# EAGLE design SatNOGSBoard (EAGLE 7.2.0)

## Sheet 1 of 14
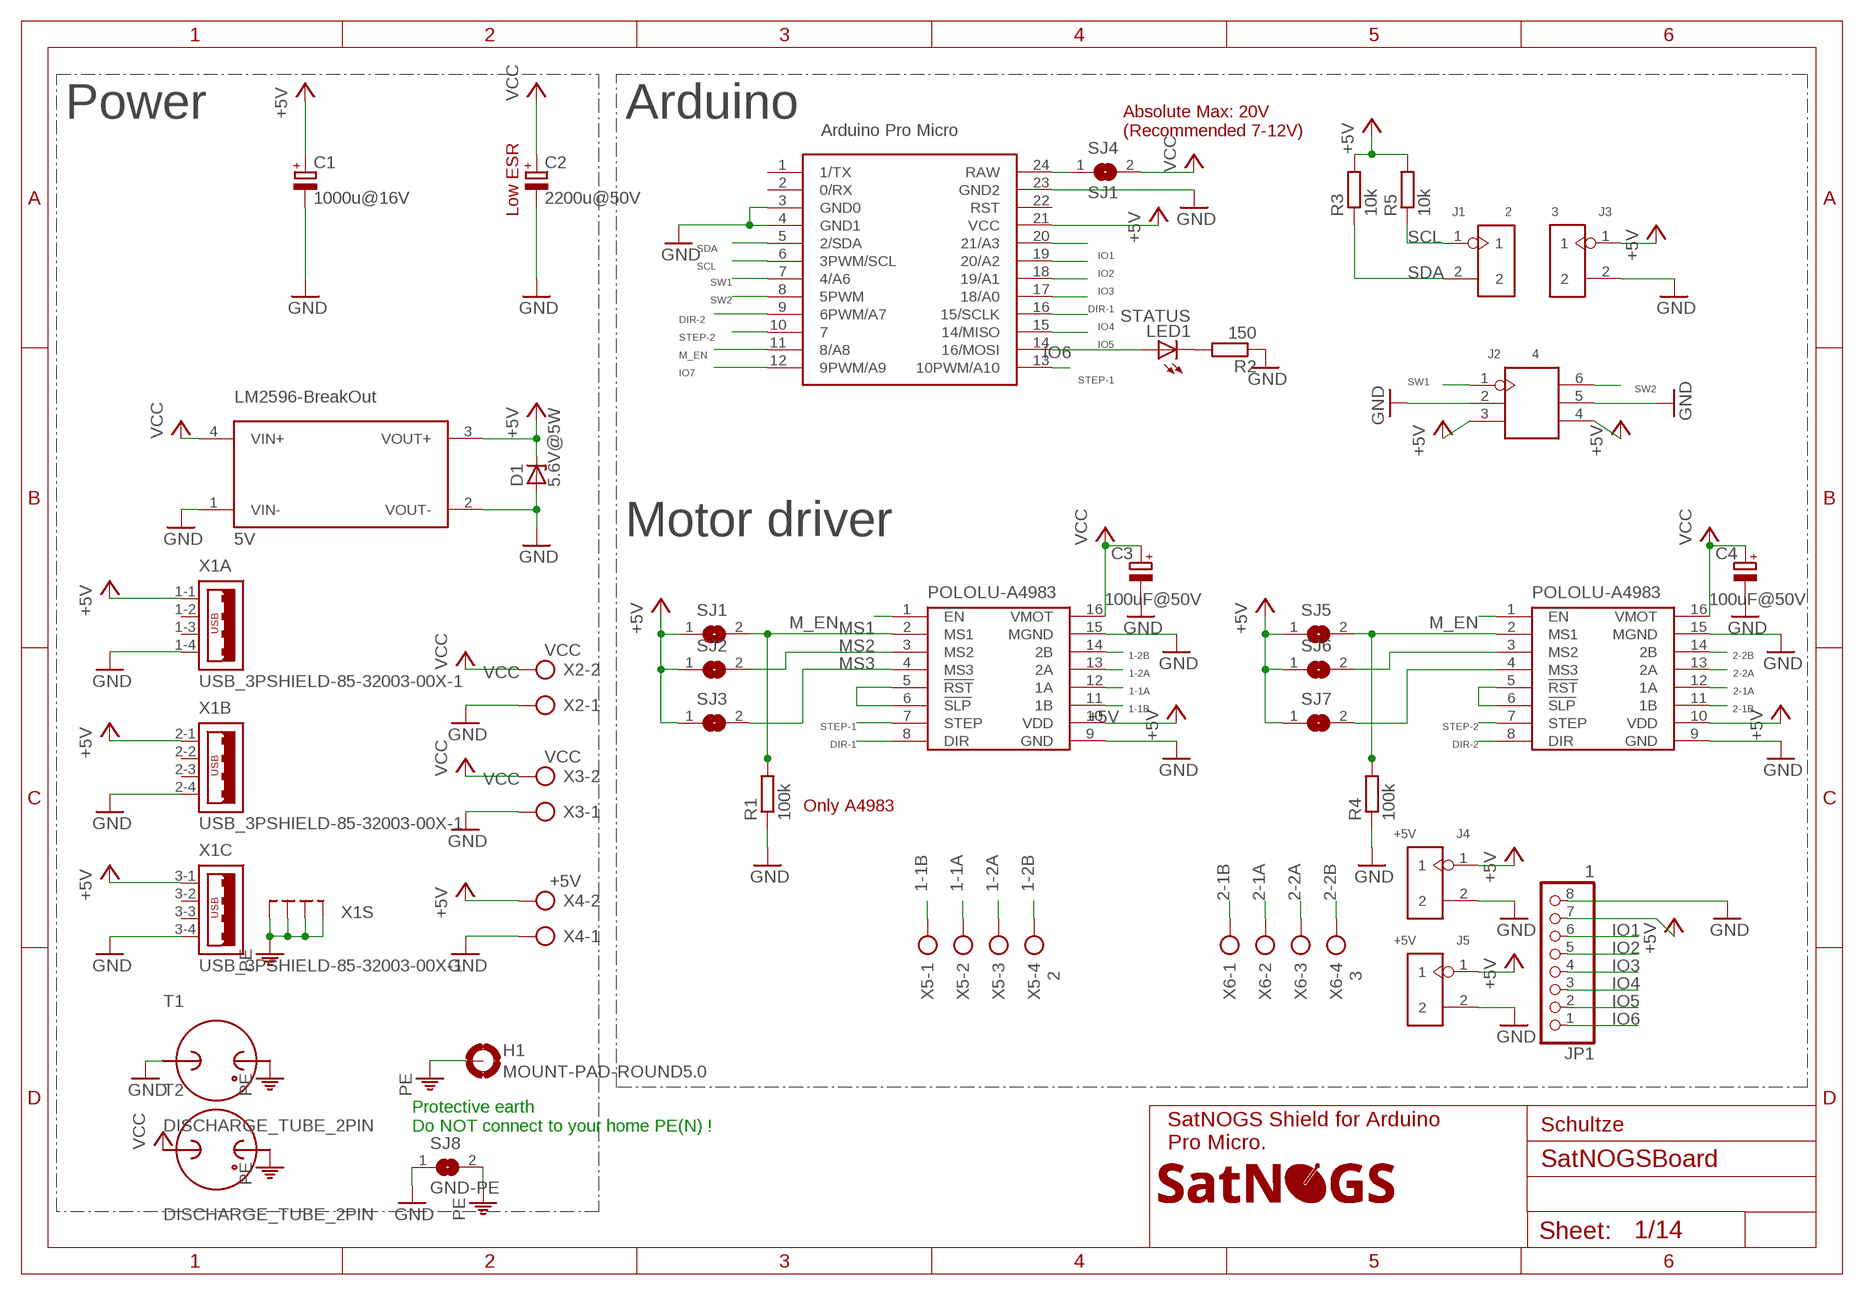
[diagram p0: schematic, sheet 1]

### Parts
B1  5V  LM2596-BREAKOUTLM2596-BREAKOUT  [LM2596-BREAKOUT]
B2  ARDUINO_PRO_MICRO"  [ARDUINO_MICRO_PRO]
B3  POLOLU-A4983/A4988"  [POLOLU-A4983]
B4  POLOLU-A4983/A4988"  [POLOLU-A4983]
C1  1000u@16V  CPOL-EUE3.5-8  [E3,5-8]
C2  2200u@50V  CPOL-EUE7.5-16  [E7,5-16]
C3  100uF@50V  CPOL-EUE2.5-6  [E2,5-6]
C4  100uF@50V  CPOL-EUE2.5-6  [E2,5-6]
D1  5.6V@5W  ZENER-DIODEDO41Z10  [DO41Z10]
H1  MOUNT-PAD-ROUND5.0  [5,0-PAD]
J1  2  HEADER-2P-65/35MIL  [2P-2.54-65/35MIL]
J2  4  HEADER-2X3P-2.54  [2X3P-2.54-65/35MIL]
J3  3  HEADER-2P-65/35MIL  [2P-2.54-65/35MIL]
J4  +5V  HEADER-2P-65/35MIL  [2P-2.54-65/35MIL]
J5  +5V  HEADER-2P-65/35MIL  [2P-2.54-65/35MIL]
JP1  1  PINHD-1X8  [1X08]
LED1  STATUS  LED3MM  [LED3MM]
LOGO1  SATNOGS_LOGOSILK_M  [LOGO_SILK_M]
R1  100k  R-EU_R0805  [R0805]
R2  150  R-EU_R0805  [R0805]
R3  10k  R-EU_R0805  [R0805]
R4  100k  R-EU_R0805  [R0805]
R5  10k  R-EU_R0805  [R0805]
SJ1  SJ1  SJ  [SJ]
SJ2  SJ1  SJ  [SJ]
SJ3  SJ1  SJ  [SJ]
SJ4  SJ1  SJ  [SJ]
SJ5  SJ1  SJ  [SJ]
SJ6  SJ1  SJ  [SJ]
SJ7  SJ1  SJ  [SJ]
SJ8  GND-PE  SJ  [SJ]
T1  DISCHARGE_TUBE_2PIN  [DISCHARGE_2WIRE]
T2  DISCHARGE_TUBE_2PIN  [DISCHARGE_2WIRE]
X1  USB_3PSHIELD-85-32003-00X-1  [85-32003-00X-1]
X2  VCC  AK500/2  [AK500/2]
X3  VCC  AK500/2  [AK500/2]
X4  +5V  AK500/2  [AK500/2]
X5  2  AK500/4  [AK500/4]
X6  3  AK500/4  [AK500/4]

### Nets
1-1A [power]: B3.12(1A) X5.2
1-1B [power]: B3.11(1B) X5.1
1-2A [power]: B3.13(2A) X5.3
1-2B [power]: B3.14(2B) X5.4
2-1A [power]: B4.12(1A) X6.2
2-1B [power]: B4.11(1B) X6.1
2-2A [power]: B4.13(2A) X6.3
2-2B [power]: B4.14(2B) X6.4
+5V: B1.3(VOUT+) B2.21(VCC) B3.10(VDD) B4.10(VDD) C1.+ D1.C J2.3 J2.4 J3.1 J4.1 J5.1 JP1.7 R3.2 R5.2 SJ1.1 SJ2.1 SJ3.1 SJ5.1 SJ6.1 SJ7.1 X1.1-1 X1.2-1 X1.3-1 X4.2 ; also sheet 6,7,8
DIR-1: B2.17(18/A0) B3.8(DIR)
DIR-2: B2.9(6PWM/A7) B4.8(DIR)
GND: B1.1(VIN-) B1.2(VOUT-) B2.3(GND0) B2.4(GND1) B2.23(GND2) B3.9(GND) B3.15(MGND) B4.9(GND) B4.15(MGND) C1.- C2.- C3.- C4.- D1.A J2.2 J2.5 J3.2 J4.2 J5.2 JP1.8 R1.1 R2.1 R4.1 SJ8.1 T1.P$1 X1.1-4 X1.2-4 X1.3-4 X2.1 X3.1 X4.1 ; also sheet 2,3,4,5,6,7,8,9,10,11,12,13,14
IO1: B2.20(21/A3) JP1.6
IO2: B2.19(20/A2) JP1.5
IO3: B2.18(19/A1) JP1.4
IO4: B2.16(15/SCLK) JP1.3
IO5: B2.15(14/MISO) JP1.2
IO6: B2.14(16/MOSI) JP1.1 LED1.A
IO7: B2.12(9PWM/A9)
M_EN: B2.11(8/A8) B3.1(!EN) B4.1(!EN)
MS1: B3.2(MS1) R1.2 SJ1.2
MS2: B3.3(MS2) SJ2.2
MS3: B3.4(MS3) SJ3.2
MS4: B4.2(MS1) R4.2 SJ5.2
MS5: B4.3(MS2) SJ6.2
MS6: B4.4(MS3) SJ7.2
N$1: B3.5(!RST) B3.6(!SLP)
N$2: B4.5(!RST) B4.6(!SLP)
N$3: B2.24(RAW) SJ4.1
N$6: LED1.K(C) R2.2
PE: H1.B5(MOUNT) SJ8.2 T1.P$2 T2.P$2 X1.M1(S:S1) X1.M2(S:S2) X1.M3(S:S3) X1.M4(S:S4)
SCL: B2.6(3PWM/SCL) J1.1 R5.1
SDA: B2.5(2/SDA) J1.2 R3.1
STEP-1: B2.13(10PWM/A10) B3.7(STEP)
STEP-2: B2.10 B4.7(STEP)
SW1: B2.7(4/A6) J2.1
SW2: B2.8(5PWM) J2.6
VCC [power]: B1.4(VIN+) B3.16(VMOT) B4.16(VMOT) C2.+ C3.+ C4.+ SJ4.2 T2.P$1 X2.2 X3.2 ; also sheet 2,3,4,5,9,10,11,12,13,14
Unconnected: B2.1(1/TX) B2.2(0/RX) B2.22(RST) X1.1-2 X1.1-3 X1.2-2 X1.2-3 X1.3-2 X1.3-3

### Notes on the sheet
- Power | Arduino
- Absolute Max: 20V
  (Recommended 7-12V)
- Low ESR
- Motor driver
- Only A4983
- Protective earth
  Do NOT connect to your home PE(N) !
- Schultze
- SatNOGS Shield for Arduino
  Pro Micro.

## Sheet 2 of 14
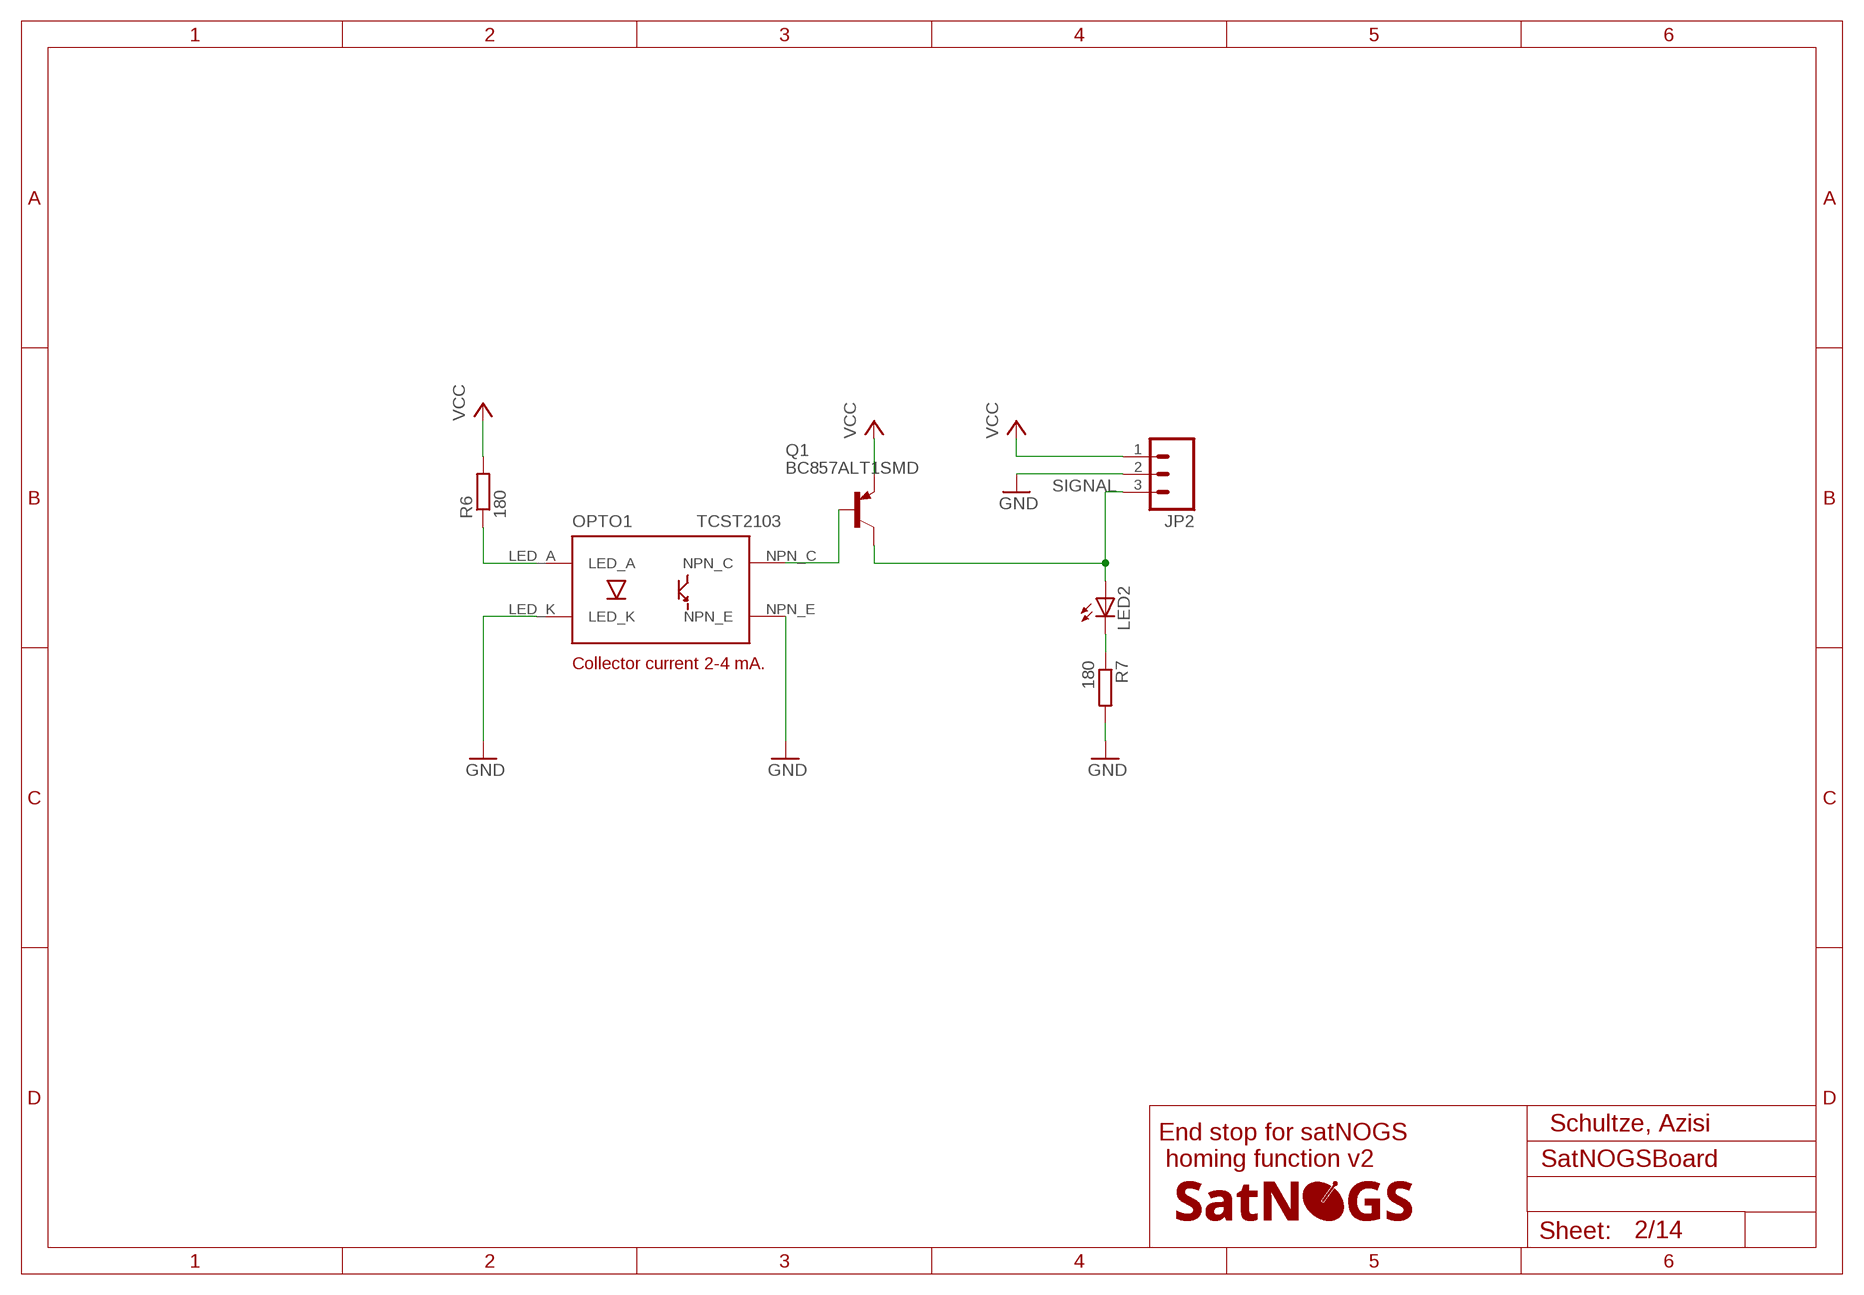
[diagram p1: schematic, sheet 2]

### Parts
JP2  M03PTH  [1X03]
LED2  LED3MM  [LED3MM]
LOGO2  SATNOGS_LOGOSILK_XS  [LOGO_SILK_XS]
OPTO1  TCST2103  [TCST2013]
Q1  BC857ALT1SMD  [SOT23-BEC]
R6  180  R-EU_R0805  [R0805]
R7  180  R-EU_R0805  [R0805]

### Nets
GND: JP2.2 OPTO1.LED_K R7.2 ; also sheet 1,3,4,5,6,7,8,9,10,11,12,13,14
N$4: OPTO1.LED_A R6.1
N$5: LED2.K(C) R7.1
N$7: OPTO1.NPN_C Q1.B
SIGNAL: JP2.3 LED2.A Q1.C ; also sheet 3,4,5,10,11,12,13,14
VCC [power]: JP2.1 Q1.E R6.2 ; also sheet 1,3,4,5,9,10,11,12,13,14
Unconnected: OPTO1.NPN_E

### Notes on the sheet
- Collector current 2-4 mA.
- Schultze, Azisi
- End stop for satNOGS
   homing function v2

## Sheet 3 of 14
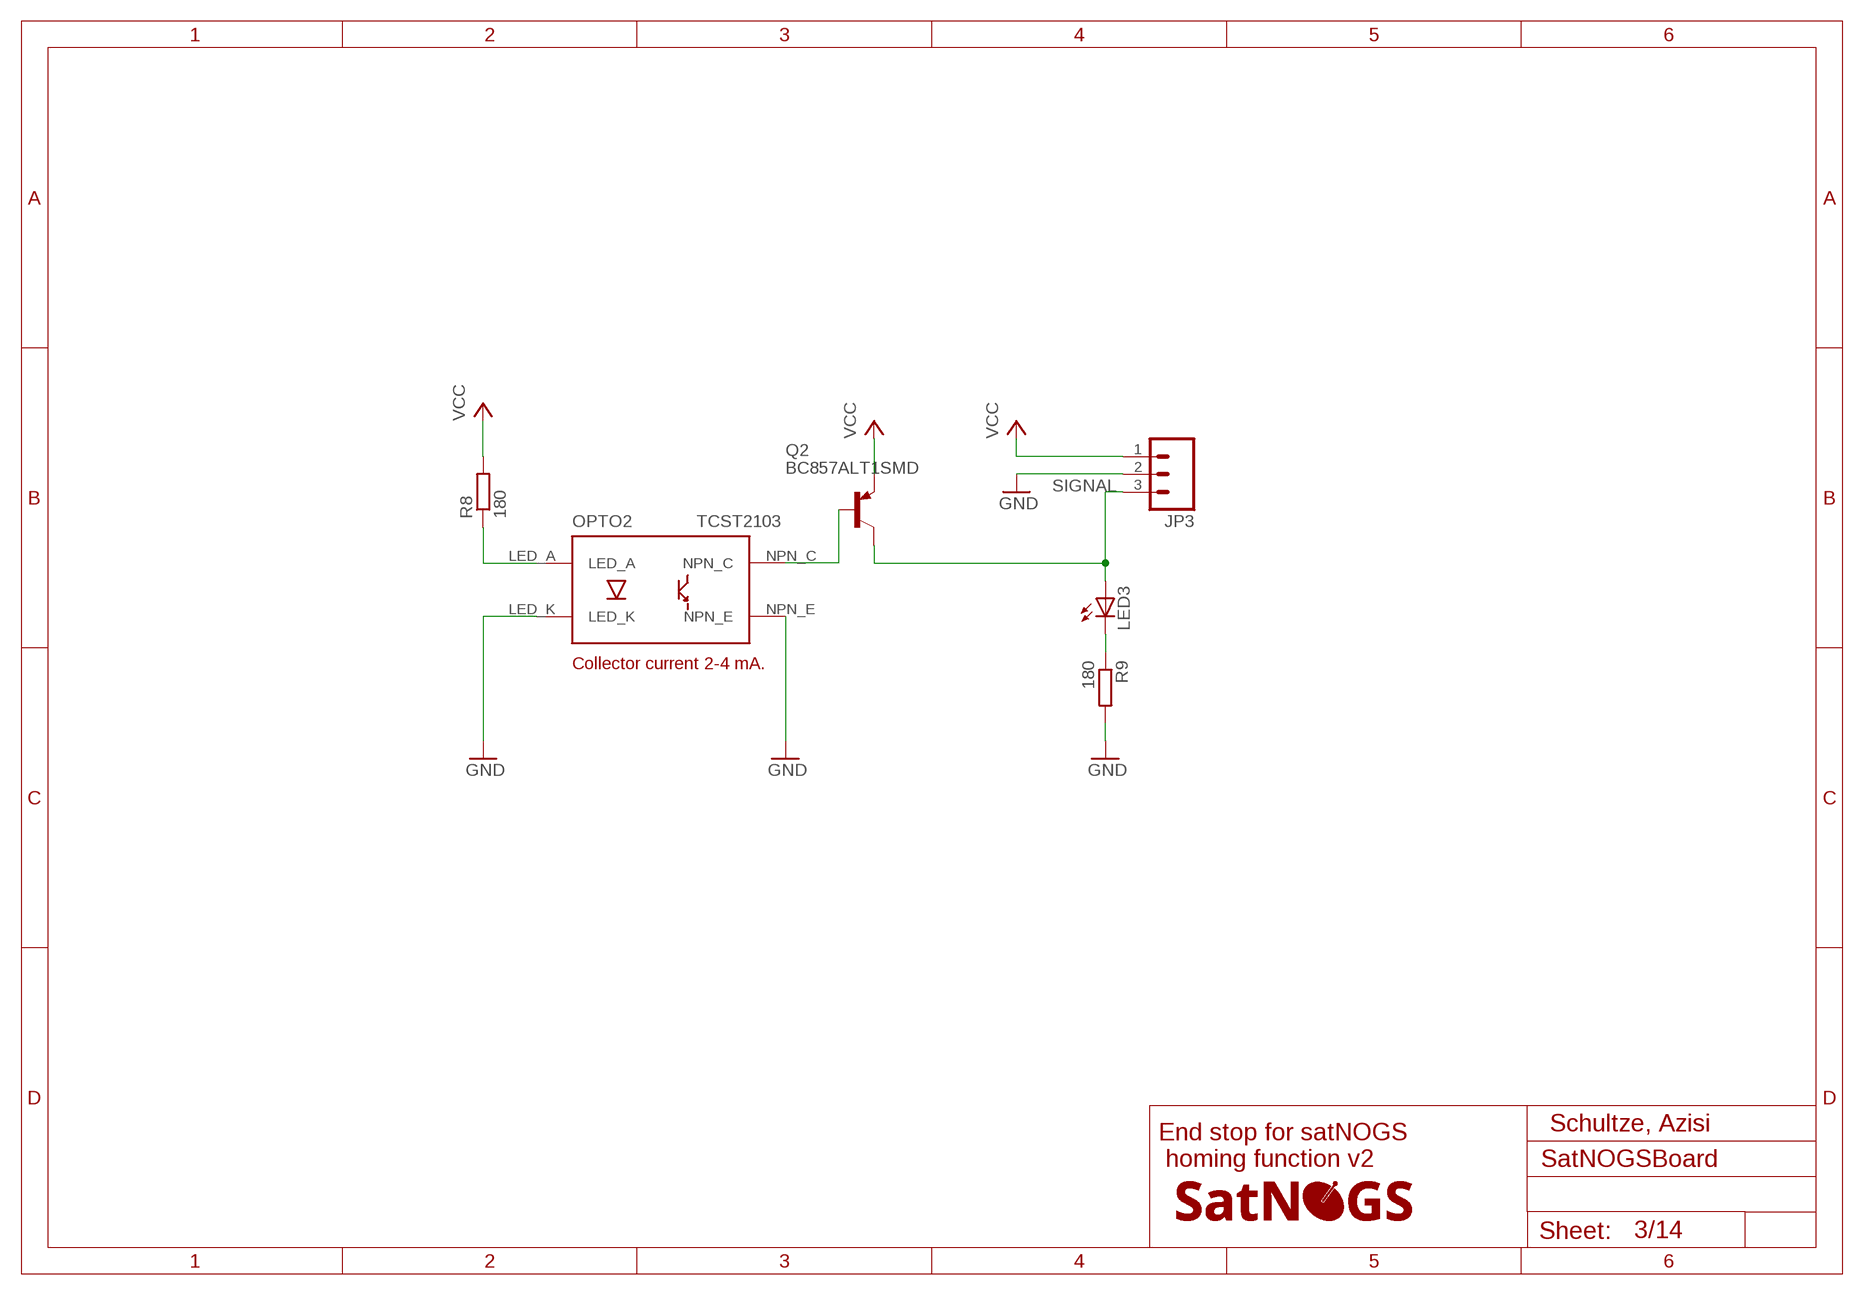
[diagram p2: schematic, sheet 3]

### Parts
JP3  M03PTH  [1X03]
LED3  LED3MM  [LED3MM]
LOGO3  SATNOGS_LOGOSILK_XS  [LOGO_SILK_XS]
OPTO2  TCST2103  [TCST2013]
Q2  BC857ALT1SMD  [SOT23-BEC]
R8  180  R-EU_R0805  [R0805]
R9  180  R-EU_R0805  [R0805]

### Nets
GND: JP3.2 OPTO2.LED_K R9.2 ; also sheet 1,2,4,5,6,7,8,9,10,11,12,13,14
N$8: OPTO2.LED_A R8.1
N$9: LED3.K(C) R9.1
N$10: OPTO2.NPN_C Q2.B
SIGNAL: JP3.3 LED3.A Q2.C ; also sheet 2,4,5,10,11,12,13,14
VCC [power]: JP3.1 Q2.E R8.2 ; also sheet 1,2,4,5,9,10,11,12,13,14
Unconnected: OPTO2.NPN_E

### Notes on the sheet
- Collector current 2-4 mA.
- Schultze, Azisi
- End stop for satNOGS
   homing function v2

## Sheet 4 of 14
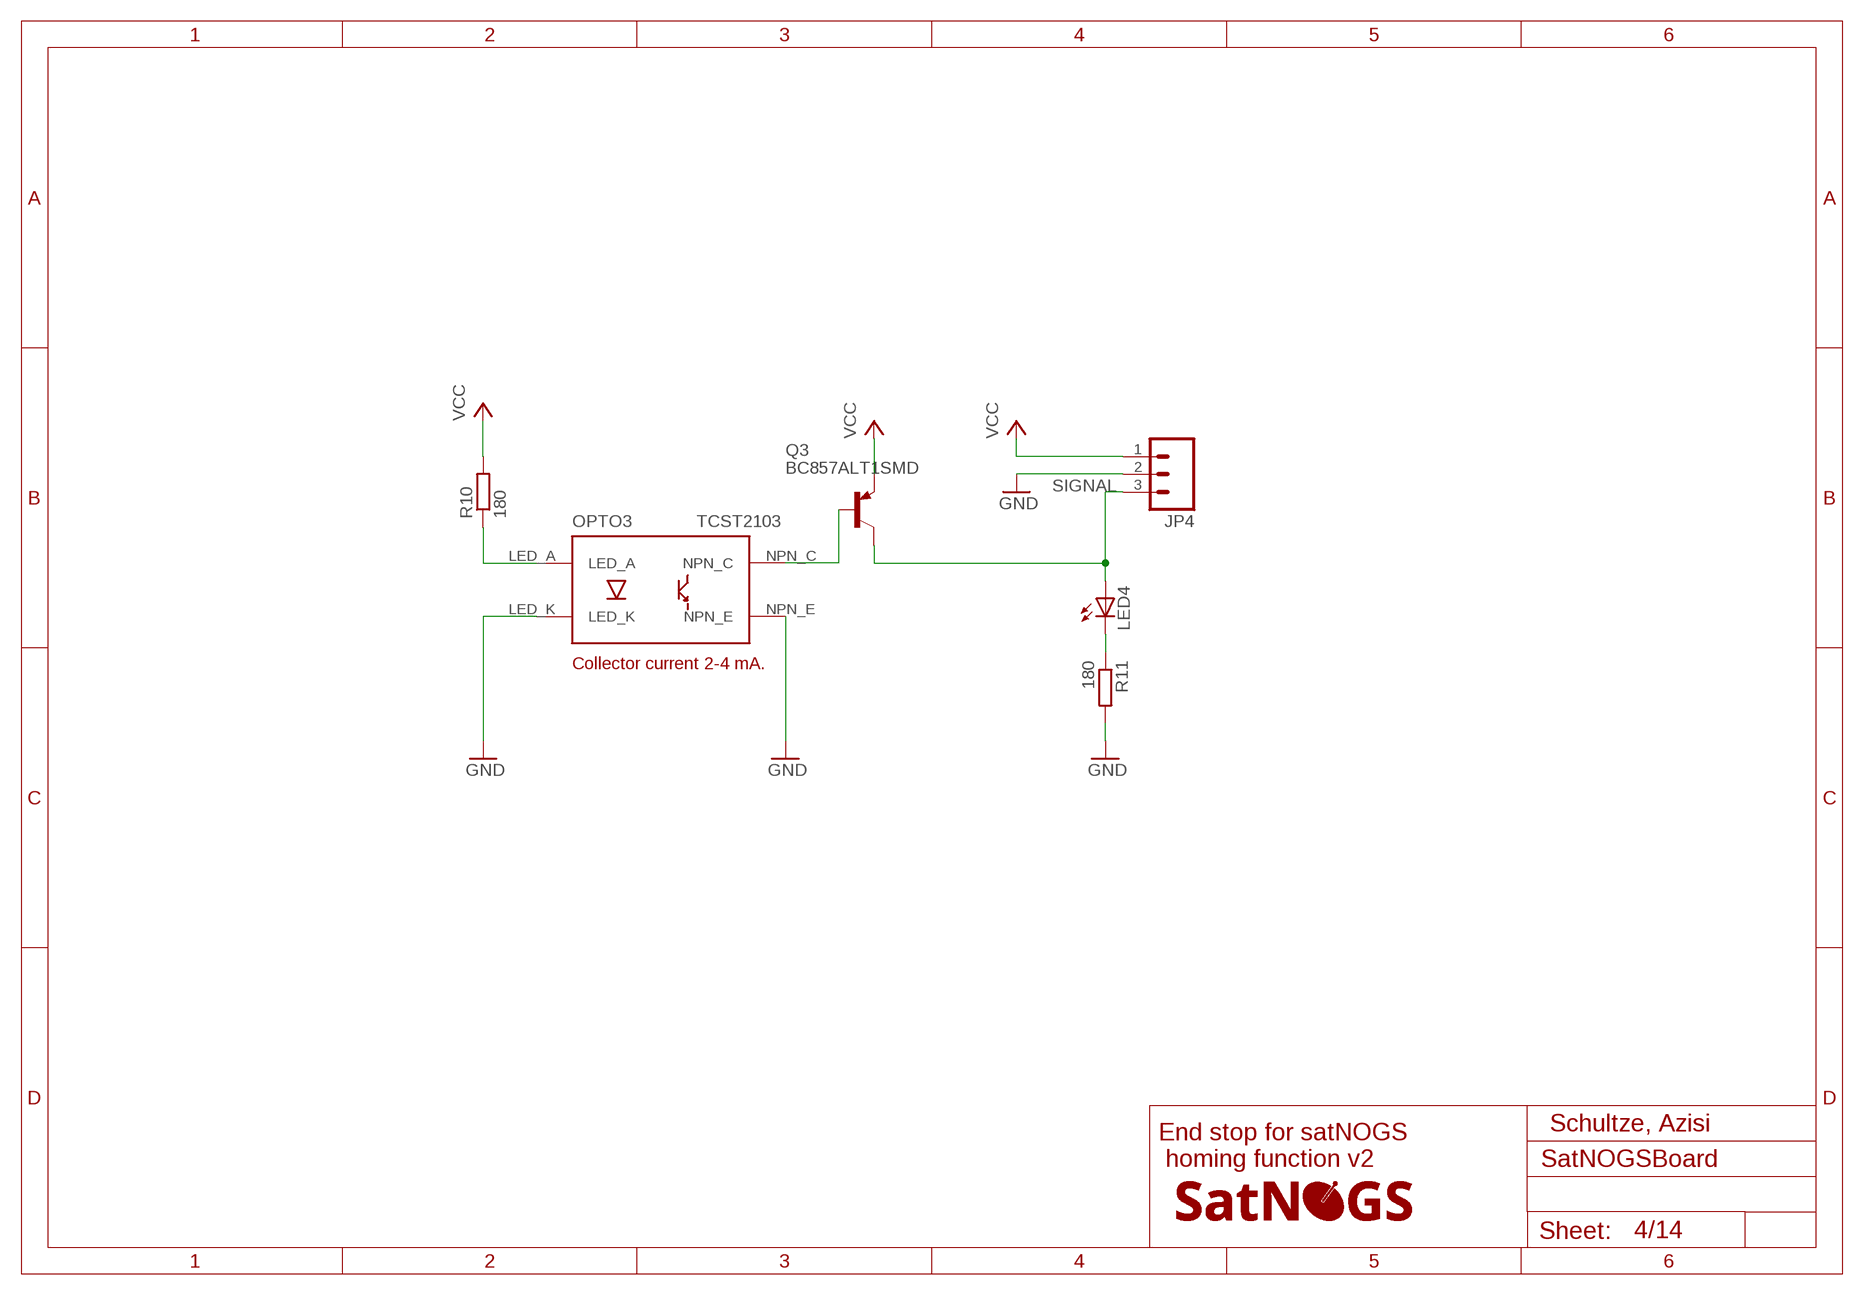
[diagram p3: schematic, sheet 4]

### Parts
JP4  M03PTH  [1X03]
LED4  LED3MM  [LED3MM]
LOGO4  SATNOGS_LOGOSILK_XS  [LOGO_SILK_XS]
OPTO3  TCST2103  [TCST2013]
Q3  BC857ALT1SMD  [SOT23-BEC]
R10  180  R-EU_R0805  [R0805]
R11  180  R-EU_R0805  [R0805]

### Nets
GND: JP4.2 OPTO3.LED_K R11.2 ; also sheet 1,2,3,5,6,7,8,9,10,11,12,13,14
N$11: OPTO3.LED_A R10.1
N$12: LED4.K(C) R11.1
N$13: OPTO3.NPN_C Q3.B
SIGNAL: JP4.3 LED4.A Q3.C ; also sheet 2,3,5,10,11,12,13,14
VCC [power]: JP4.1 Q3.E R10.2 ; also sheet 1,2,3,5,9,10,11,12,13,14
Unconnected: OPTO3.NPN_E

### Notes on the sheet
- Collector current 2-4 mA.
- Schultze, Azisi
- End stop for satNOGS
   homing function v2

## Sheet 5 of 14
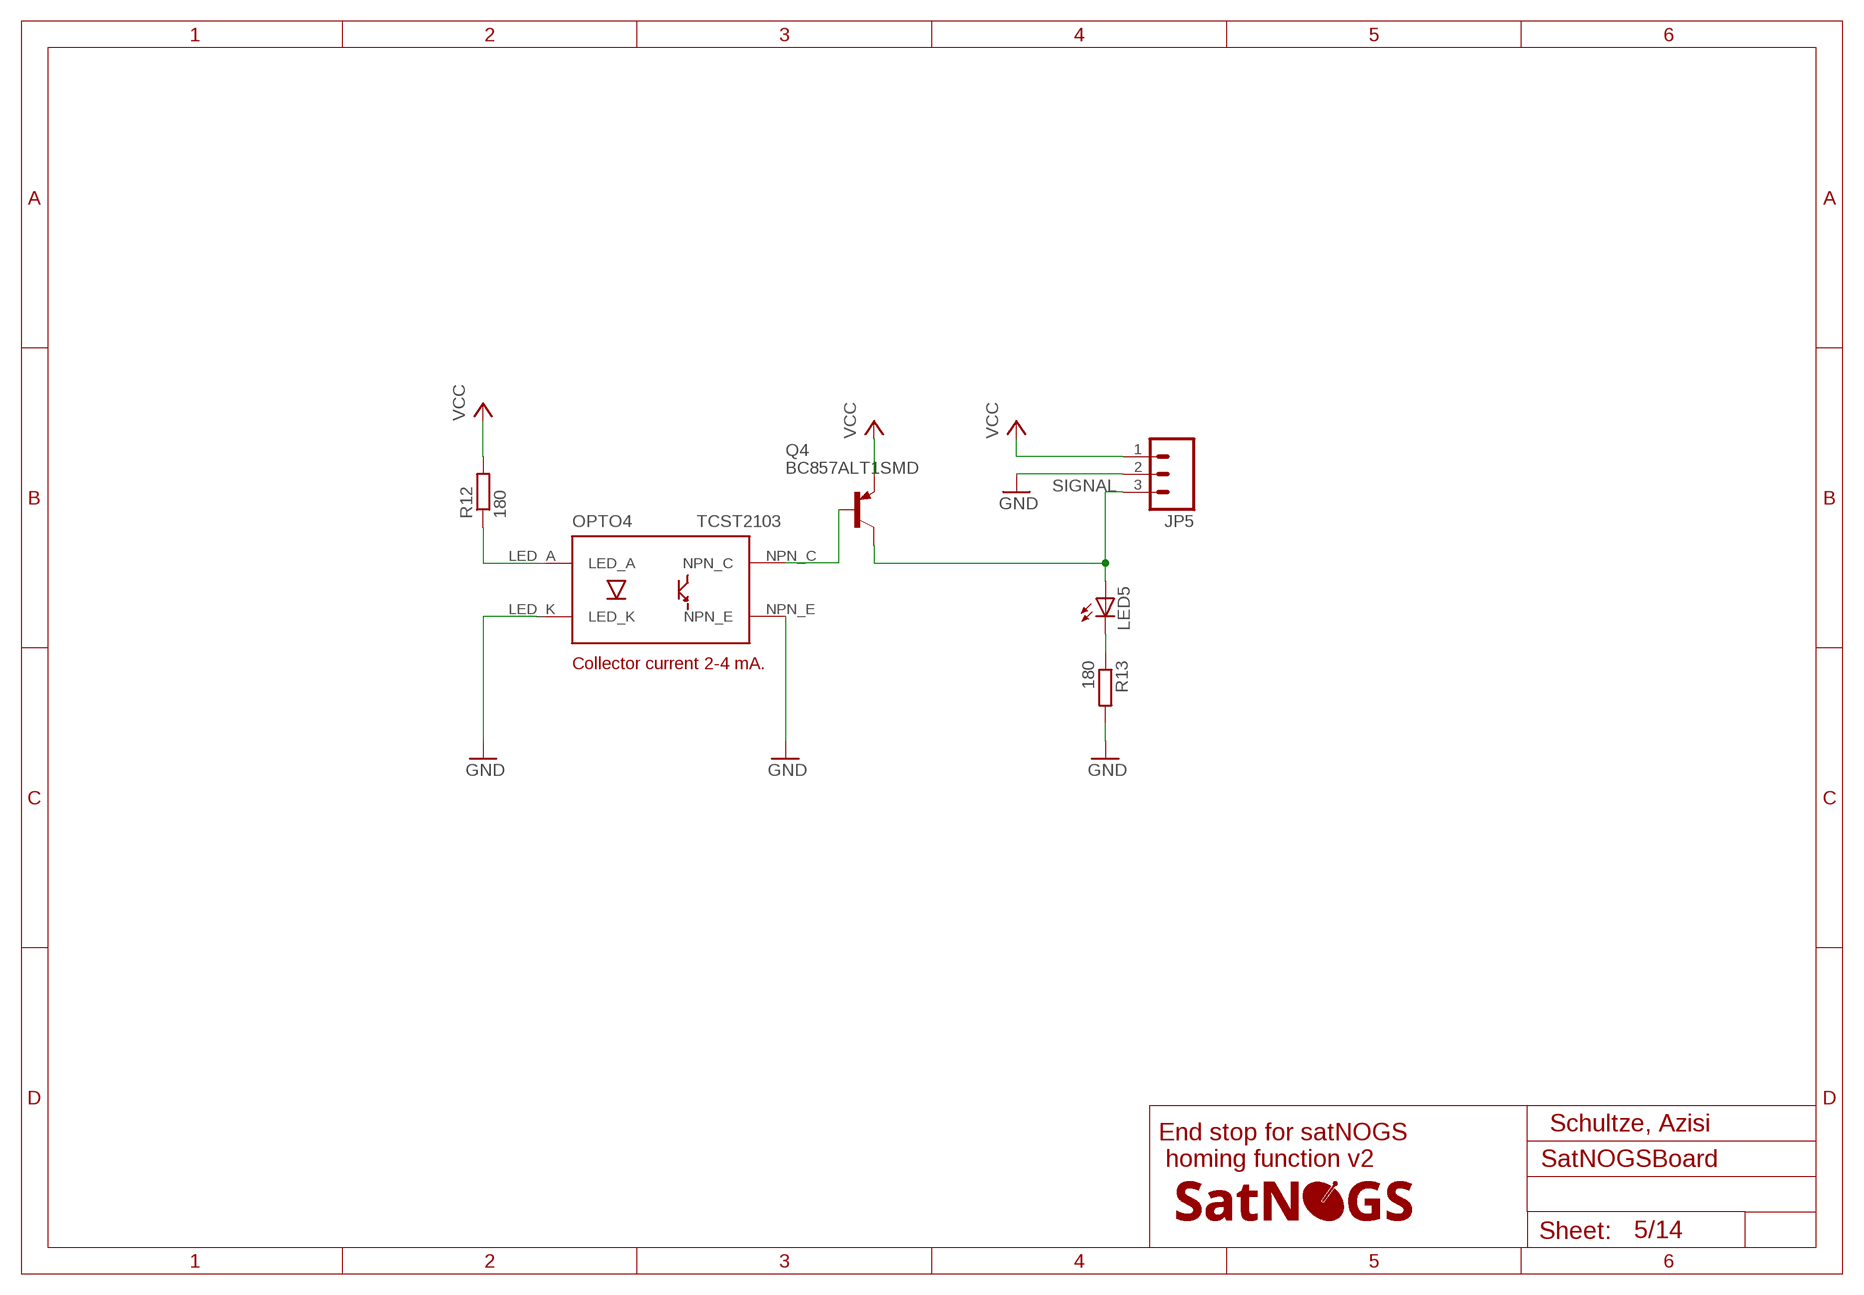
[diagram p4: schematic, sheet 5]

### Parts
JP5  M03PTH  [1X03]
LED5  LED3MM  [LED3MM]
LOGO5  SATNOGS_LOGOSILK_XS  [LOGO_SILK_XS]
OPTO4  TCST2103  [TCST2013]
Q4  BC857ALT1SMD  [SOT23-BEC]
R12  180  R-EU_R0805  [R0805]
R13  180  R-EU_R0805  [R0805]

### Nets
GND: JP5.2 OPTO4.LED_K R13.2 ; also sheet 1,2,3,4,6,7,8,9,10,11,12,13,14
N$14: OPTO4.LED_A R12.1
N$15: LED5.K(C) R13.1
N$16: OPTO4.NPN_C Q4.B
SIGNAL: JP5.3 LED5.A Q4.C ; also sheet 2,3,4,10,11,12,13,14
VCC [power]: JP5.1 Q4.E R12.2 ; also sheet 1,2,3,4,9,10,11,12,13,14
Unconnected: OPTO4.NPN_E

### Notes on the sheet
- Collector current 2-4 mA.
- Schultze, Azisi
- End stop for satNOGS
   homing function v2

## Sheet 6 of 14
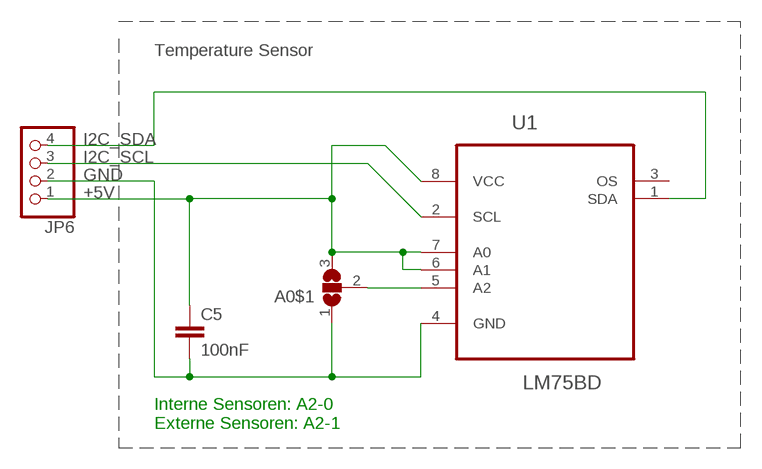
[diagram p5: schematic, sheet 6]

### Parts
A0$1  SJ2W  [SJ_2]
C5  100nF  C-EUC0805  [C0805]
JP6  PINHD-1X4  [1X04]
U1  LM75BD  [SOIC127P600X175-8N]

### Nets
+5V: A0$1.3 C5.1 JP6.1 U1.6(A1) U1.7(A0) U1.8(VCC) ; also sheet 1,7,8
GND: A0$1.1 C5.2 JP6.2 U1.4(GND) ; also sheet 1,2,3,4,5,7,8,9,10,11,12,13,14
I2C_SCL: JP6.3 U1.2(SCL) ; also sheet 7,8
I2C_SDA: JP6.4 U1.1(SDA) ; also sheet 7,8
N$17: A0$1.2 U1.5(A2)
Unconnected: U1.3(OS)

### Notes on the sheet
- Temperature Sensor
- Interne Sensoren: A2-0
  Externe Sensoren: A2-1

## Sheet 7 of 14
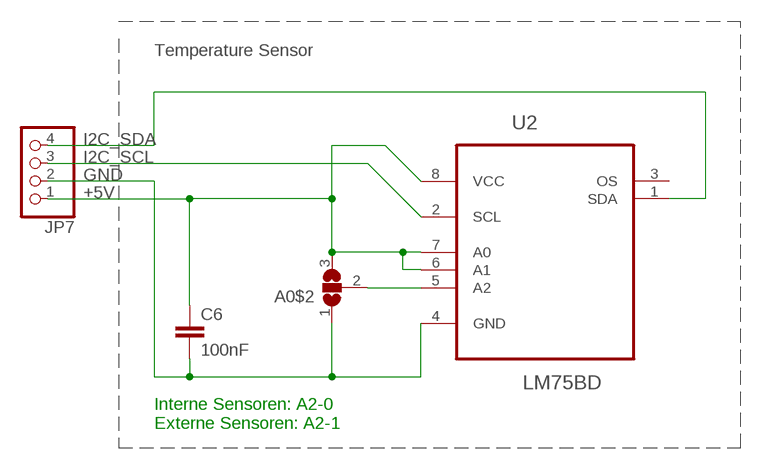
[diagram p6: schematic, sheet 7]

### Parts
A0$2  SJ2W  [SJ_2]
C6  100nF  C-EUC0805  [C0805]
JP7  PINHD-1X4  [1X04]
U2  LM75BD  [SOIC127P600X175-8N]

### Nets
+5V: A0$2.3 C6.1 JP7.1 U2.6(A1) U2.7(A0) U2.8(VCC) ; also sheet 1,6,8
GND: A0$2.1 C6.2 JP7.2 U2.4(GND) ; also sheet 1,2,3,4,5,6,8,9,10,11,12,13,14
I2C_SCL: JP7.3 U2.2(SCL) ; also sheet 6,8
I2C_SDA: JP7.4 U2.1(SDA) ; also sheet 6,8
N$18: A0$2.2 U2.5(A2)
Unconnected: U2.3(OS)

### Notes on the sheet
- Temperature Sensor
- Interne Sensoren: A2-0
  Externe Sensoren: A2-1

## Sheet 8 of 14
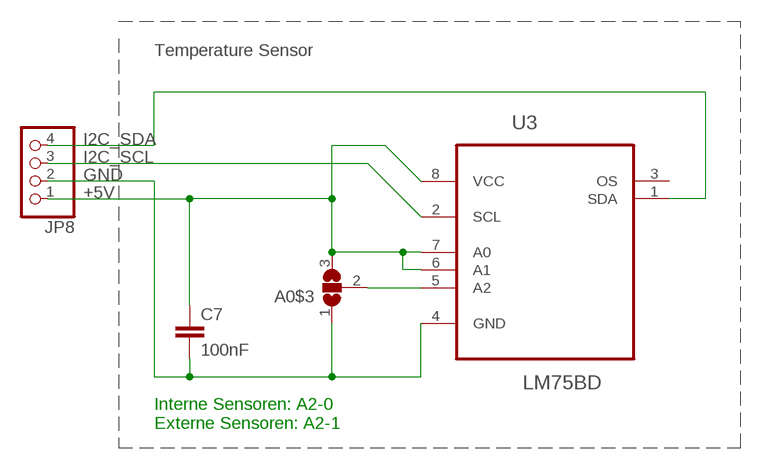
[diagram p7: schematic, sheet 8]

### Parts
A0$3  SJ2W  [SJ_2]
C7  100nF  C-EUC0805  [C0805]
JP8  PINHD-1X4  [1X04]
U3  LM75BD  [SOIC127P600X175-8N]

### Nets
+5V: A0$3.3 C7.1 JP8.1 U3.6(A1) U3.7(A0) U3.8(VCC) ; also sheet 1,6,7
GND: A0$3.1 C7.2 JP8.2 U3.4(GND) ; also sheet 1,2,3,4,5,6,7,9,10,11,12,13,14
I2C_SCL: JP8.3 U3.2(SCL) ; also sheet 6,7
I2C_SDA: JP8.4 U3.1(SDA) ; also sheet 6,7
N$19: A0$3.2 U3.5(A2)
Unconnected: U3.3(OS)

### Notes on the sheet
- Temperature Sensor
- Interne Sensoren: A2-0
  Externe Sensoren: A2-1

## Sheet 9 of 14
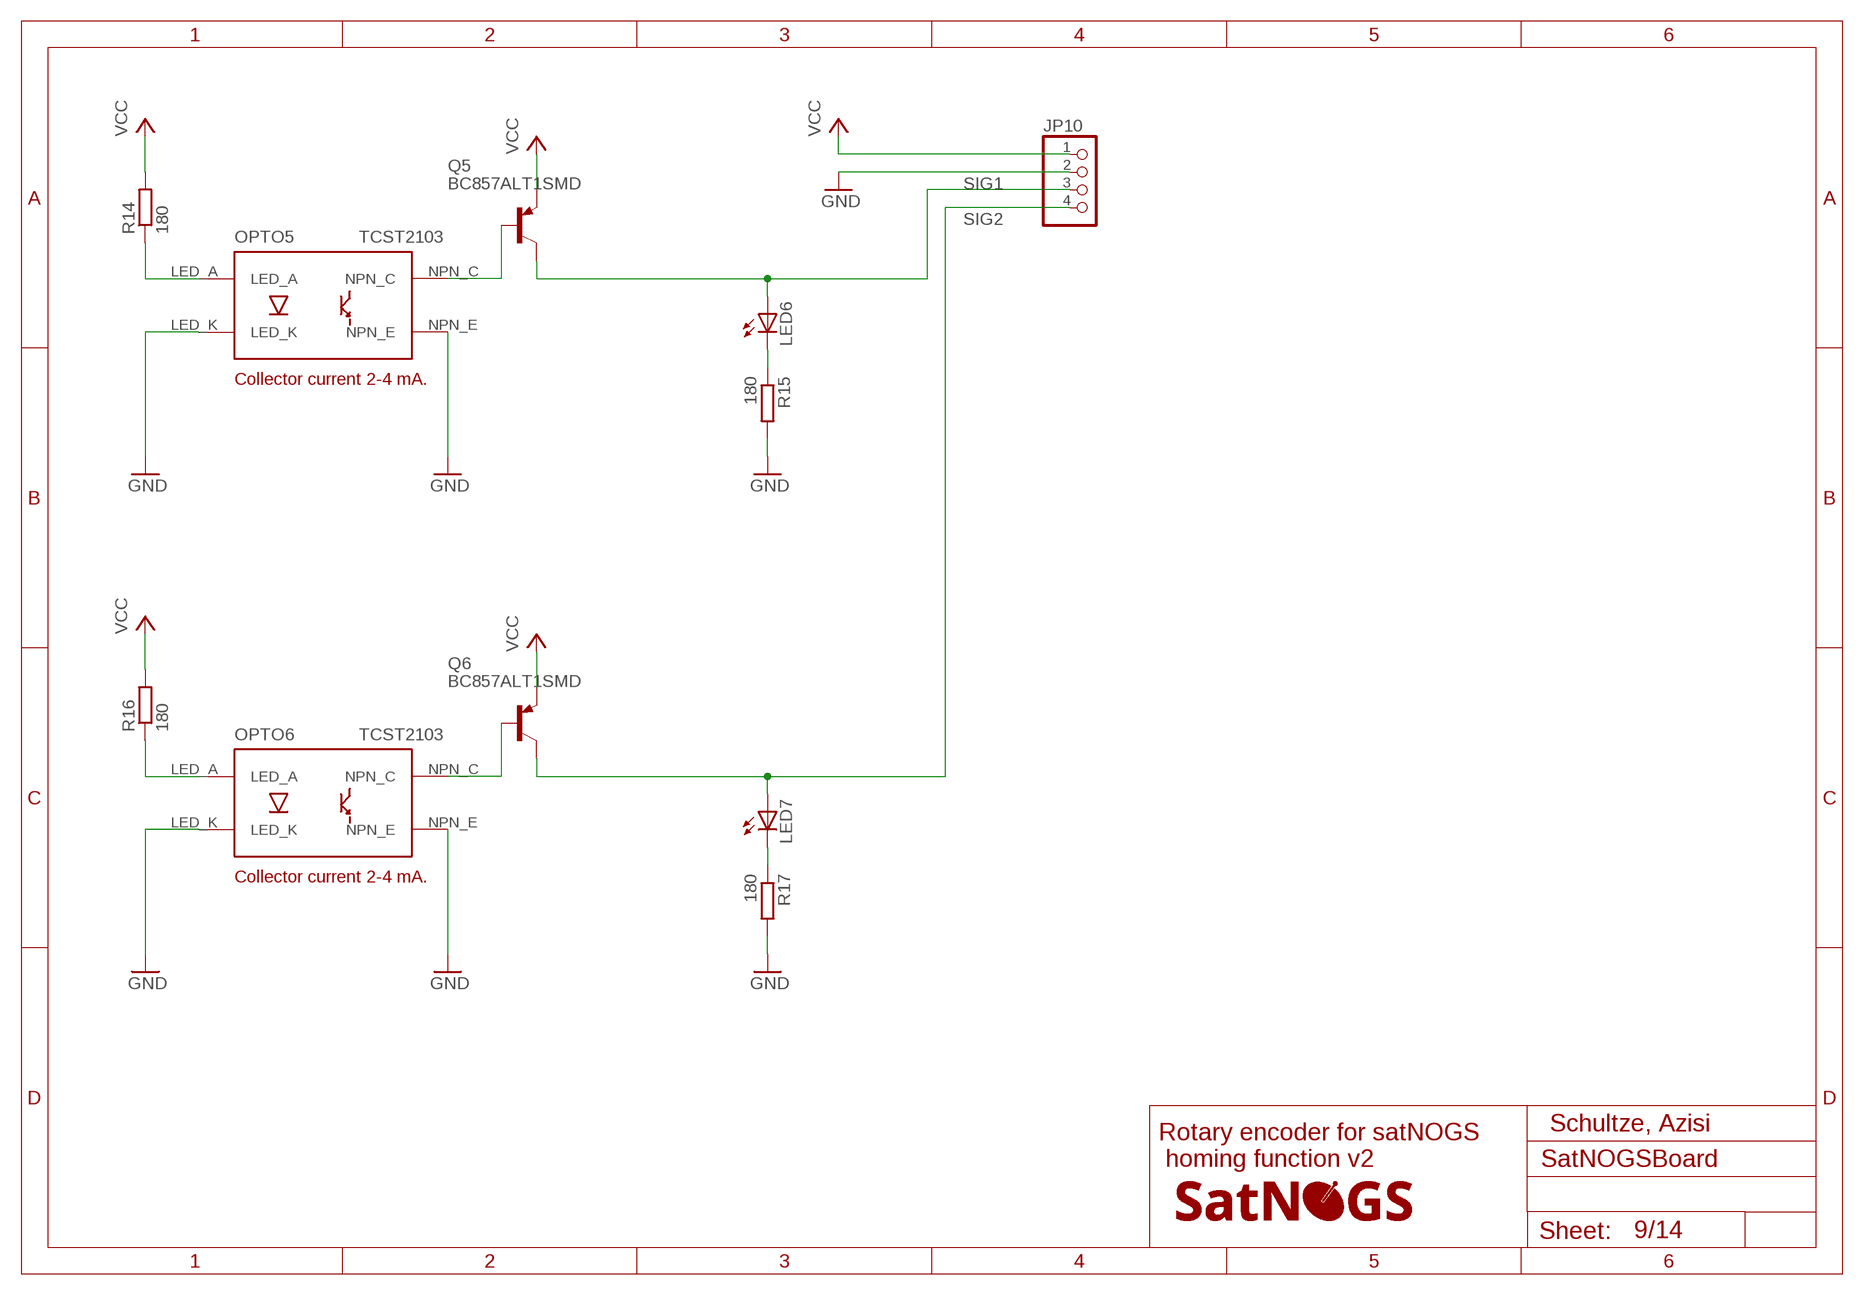
[diagram p8: schematic, sheet 9]

### Parts
JP10  PINHD-1X4  [1X04]
LED6  LED3MM  [LED3MM]
LED7  LED3MM  [LED3MM]
LOGO6  SATNOGS_LOGOSILK_XS  [LOGO_SILK_XS]
OPTO5  TCST2103  [TCST2013]
OPTO6  TCST2103  [TCST2013]
Q5  BC857ALT1SMD  [SOT23-BEC]
Q6  BC857ALT1SMD  [SOT23-BEC]
R14  180  R-EU_R0805  [R0805]
R15  180  R-EU_R0805  [R0805]
R16  180  R-EU_R0805  [R0805]
R17  180  R-EU_R0805  [R0805]

### Nets
GND: JP10.2 OPTO5.LED_K OPTO5.NPN_E OPTO6.LED_K OPTO6.NPN_E R15.2 R17.2 ; also sheet 1,2,3,4,5,6,7,8,10,11,12,13,14
N$21: OPTO5.LED_A R14.1
N$22: LED6.K(C) R15.1
N$23: OPTO5.NPN_C Q5.B
N$24: OPTO6.LED_A R16.1
N$25: LED7.K(C) R17.1
N$26: OPTO6.NPN_C Q6.B
SIG1: JP10.3 LED6.A Q5.C
SIG2: JP10.4 LED7.A Q6.C
VCC [power]: JP10.1 Q5.E Q6.E R14.2 R16.2 ; also sheet 1,2,3,4,5,10,11,12,13,14

### Notes on the sheet
- Collector current 2-4 mA.
- Collector current 2-4 mA.
- Schultze, Azisi
- Rotary encoder for satNOGS
   homing function v2

## Sheet 10 of 14
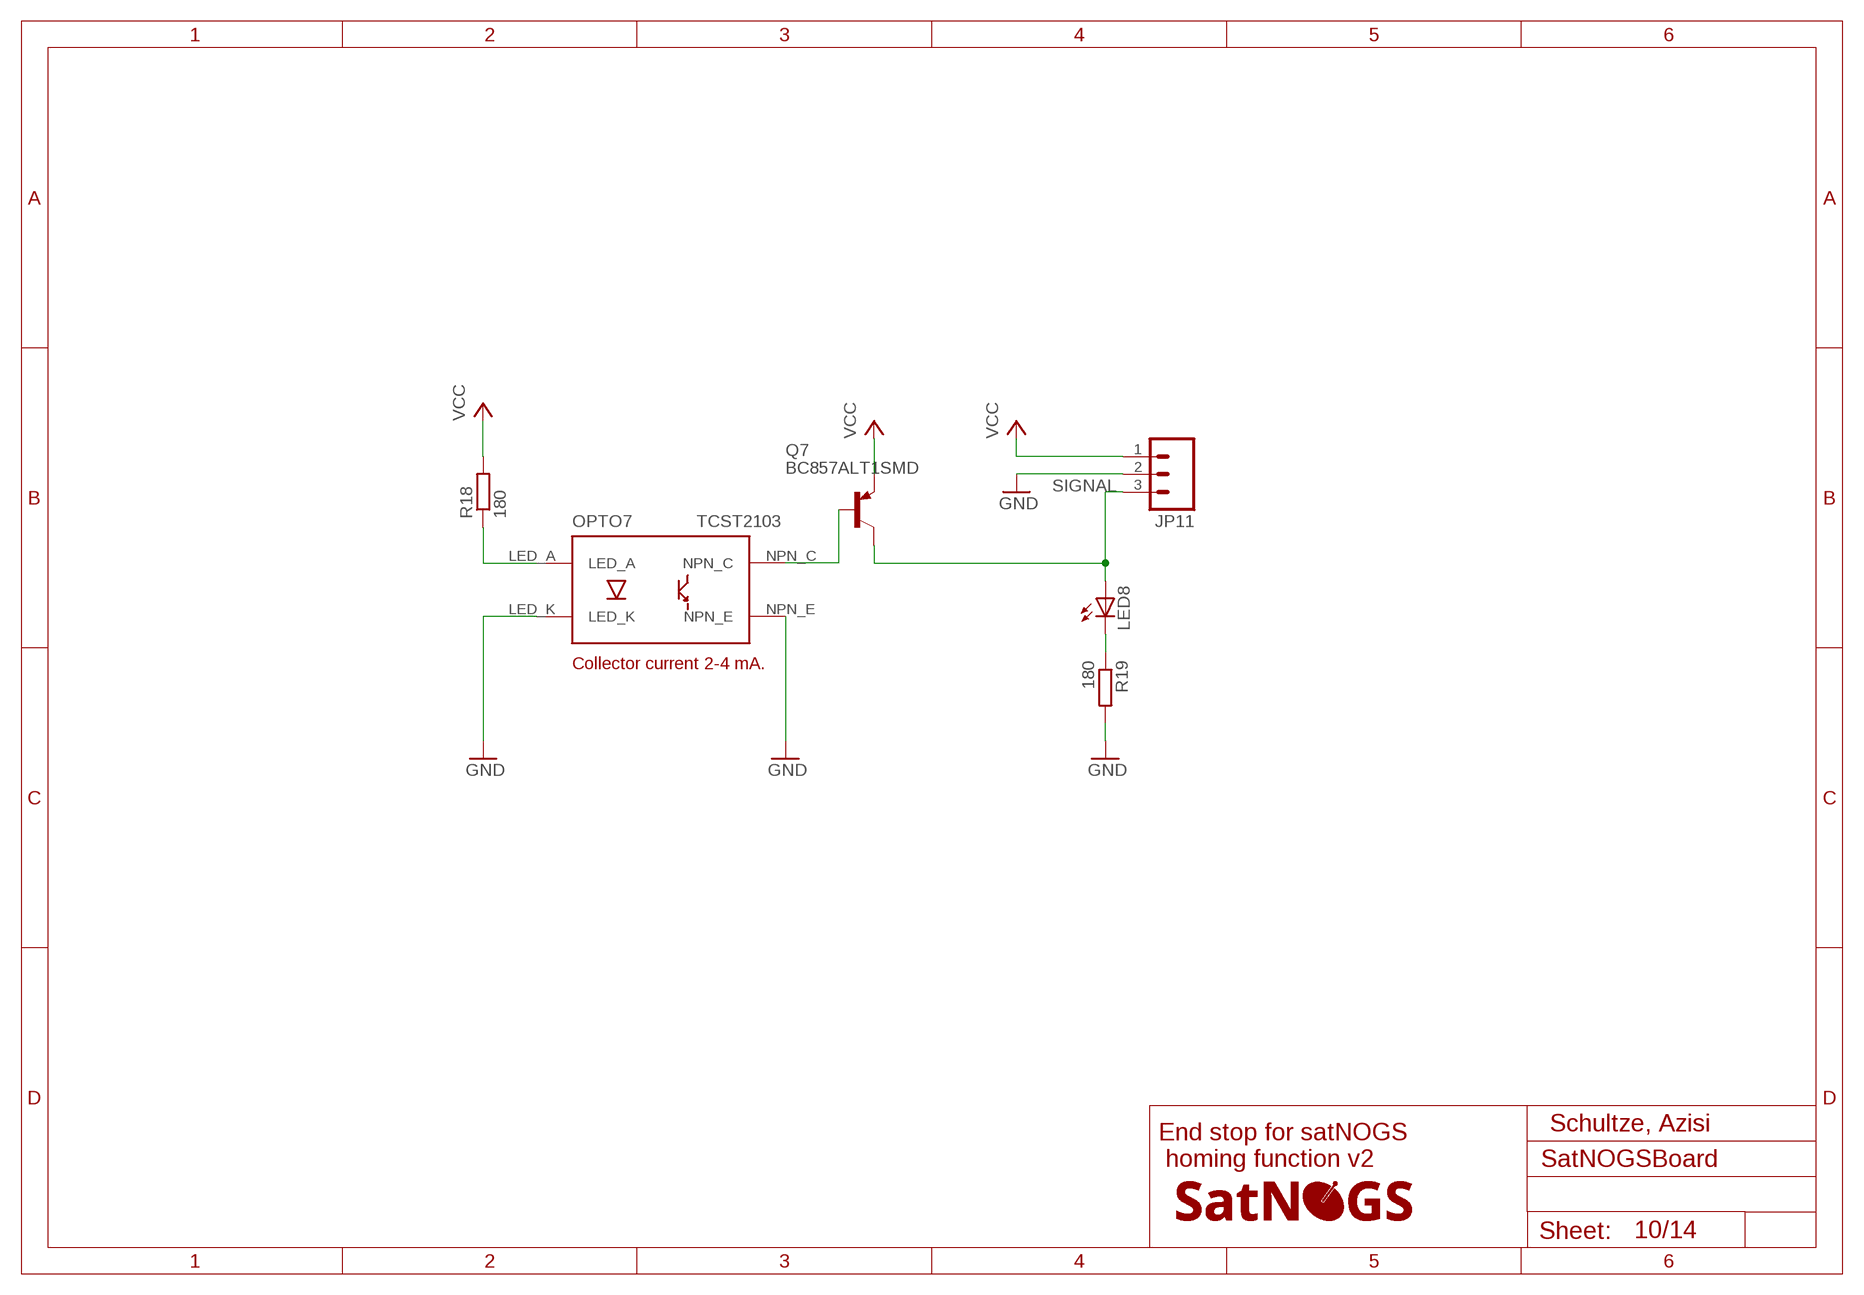
[diagram p9: schematic, sheet 10]

### Parts
JP11  M03PTH  [1X03]
LED8  LED3MM  [LED3MM]
LOGO7  SATNOGS_LOGOSILK_XS  [LOGO_SILK_XS]
OPTO7  TCST2103  [TCST2013]
Q7  BC857ALT1SMD  [SOT23-BEC]
R18  180  R-EU_R0805  [R0805]
R19  180  R-EU_R0805  [R0805]

### Nets
GND: JP11.2 OPTO7.LED_K R19.2 ; also sheet 1,2,3,4,5,6,7,8,9,11,12,13,14
N$27: OPTO7.LED_A R18.1
N$28: LED8.K(C) R19.1
N$29: OPTO7.NPN_C Q7.B
SIGNAL: JP11.3 LED8.A Q7.C ; also sheet 2,3,4,5,11,12,13,14
VCC [power]: JP11.1 Q7.E R18.2 ; also sheet 1,2,3,4,5,9,11,12,13,14
Unconnected: OPTO7.NPN_E

### Notes on the sheet
- Collector current 2-4 mA.
- Schultze, Azisi
- End stop for satNOGS
   homing function v2

## Sheet 11 of 14
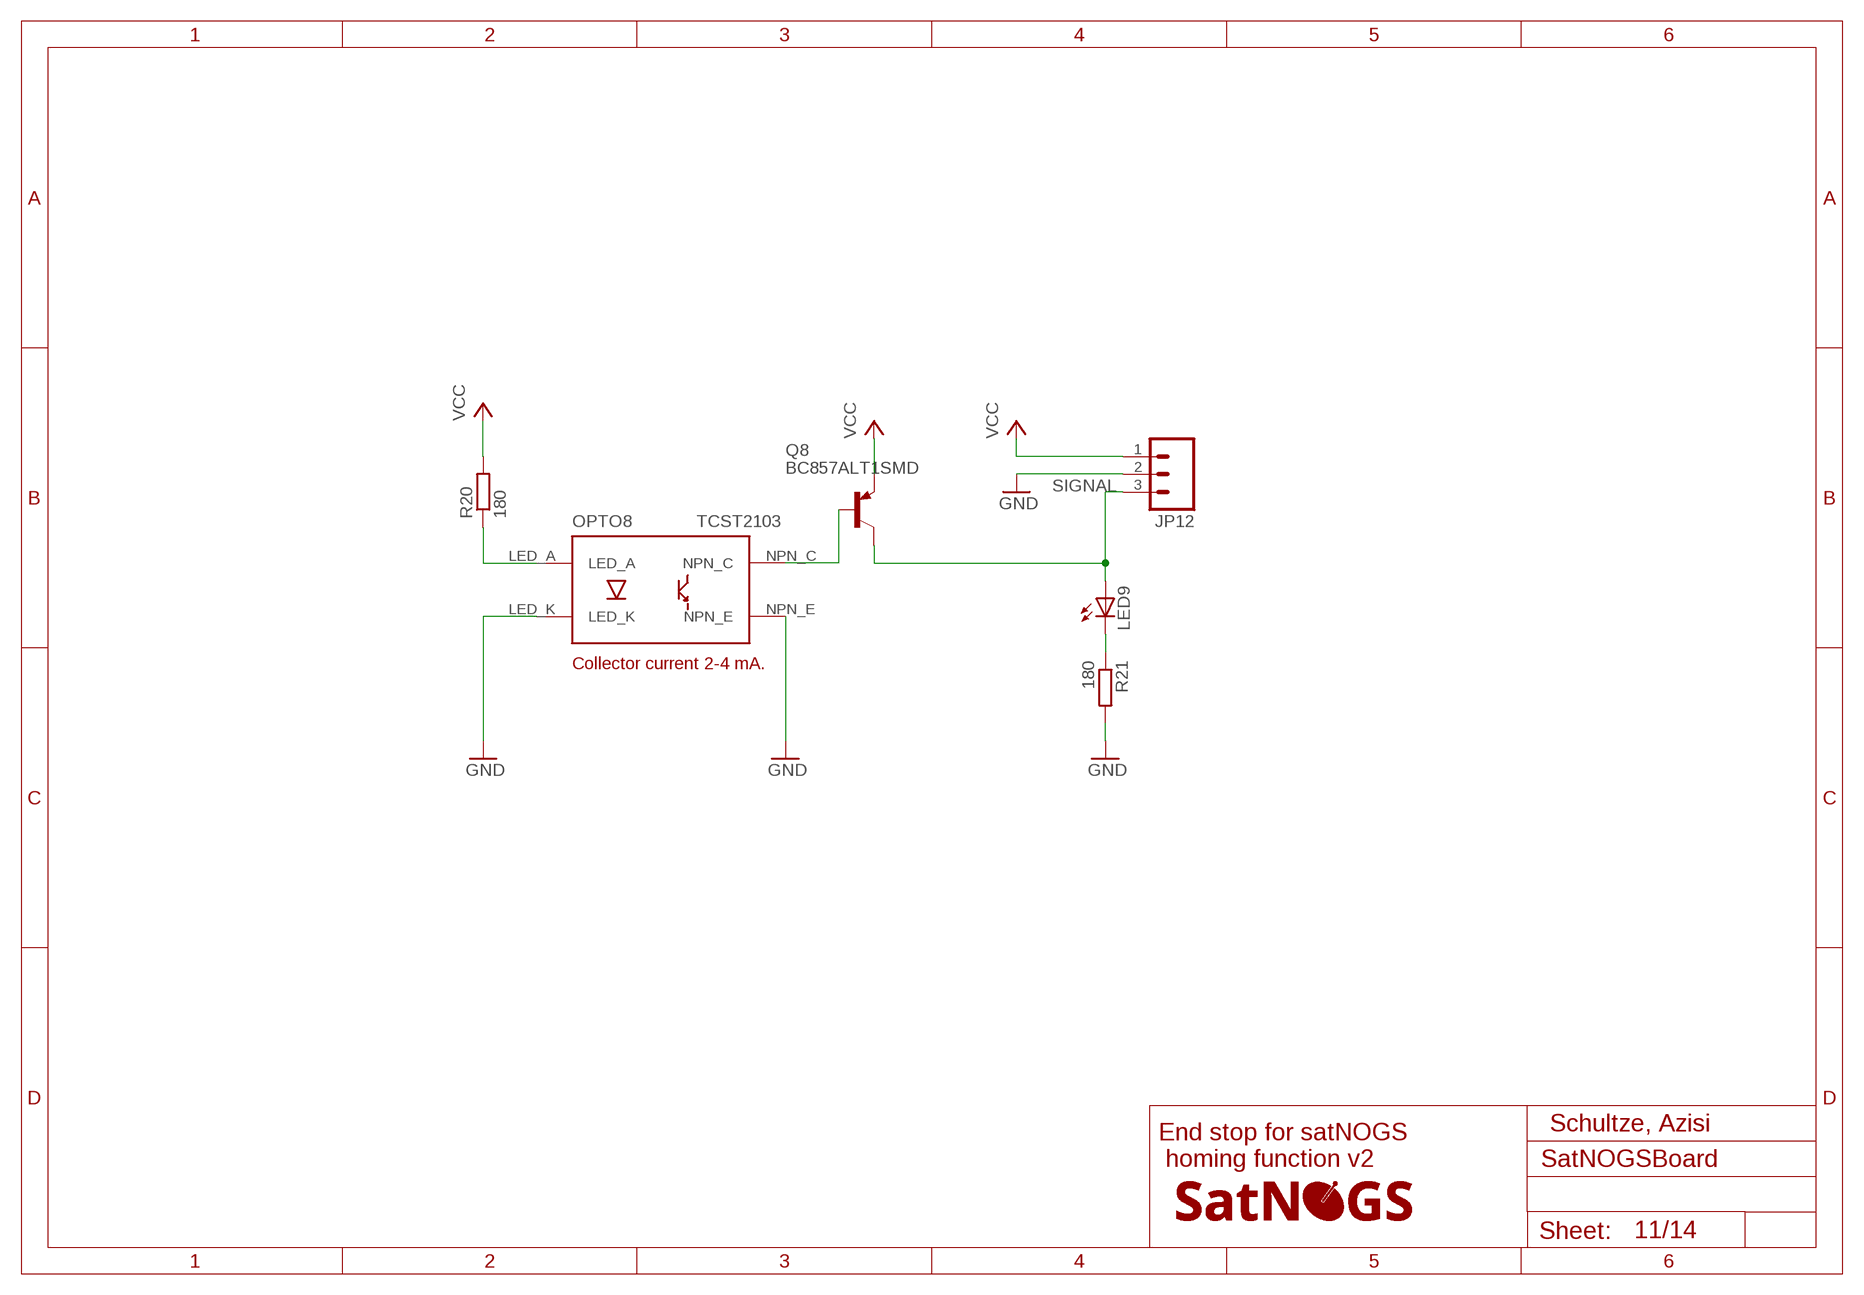
[diagram p10: schematic, sheet 11]

### Parts
JP12  M03PTH  [1X03]
LED9  LED3MM  [LED3MM]
LOGO8  SATNOGS_LOGOSILK_XS  [LOGO_SILK_XS]
OPTO8  TCST2103  [TCST2013]
Q8  BC857ALT1SMD  [SOT23-BEC]
R20  180  R-EU_R0805  [R0805]
R21  180  R-EU_R0805  [R0805]

### Nets
GND: JP12.2 OPTO8.LED_K R21.2 ; also sheet 1,2,3,4,5,6,7,8,9,10,12,13,14
N$30: OPTO8.LED_A R20.1
N$31: LED9.K(C) R21.1
N$32: OPTO8.NPN_C Q8.B
SIGNAL: JP12.3 LED9.A Q8.C ; also sheet 2,3,4,5,10,12,13,14
VCC [power]: JP12.1 Q8.E R20.2 ; also sheet 1,2,3,4,5,9,10,12,13,14
Unconnected: OPTO8.NPN_E

### Notes on the sheet
- Collector current 2-4 mA.
- Schultze, Azisi
- End stop for satNOGS
   homing function v2

## Sheet 12 of 14
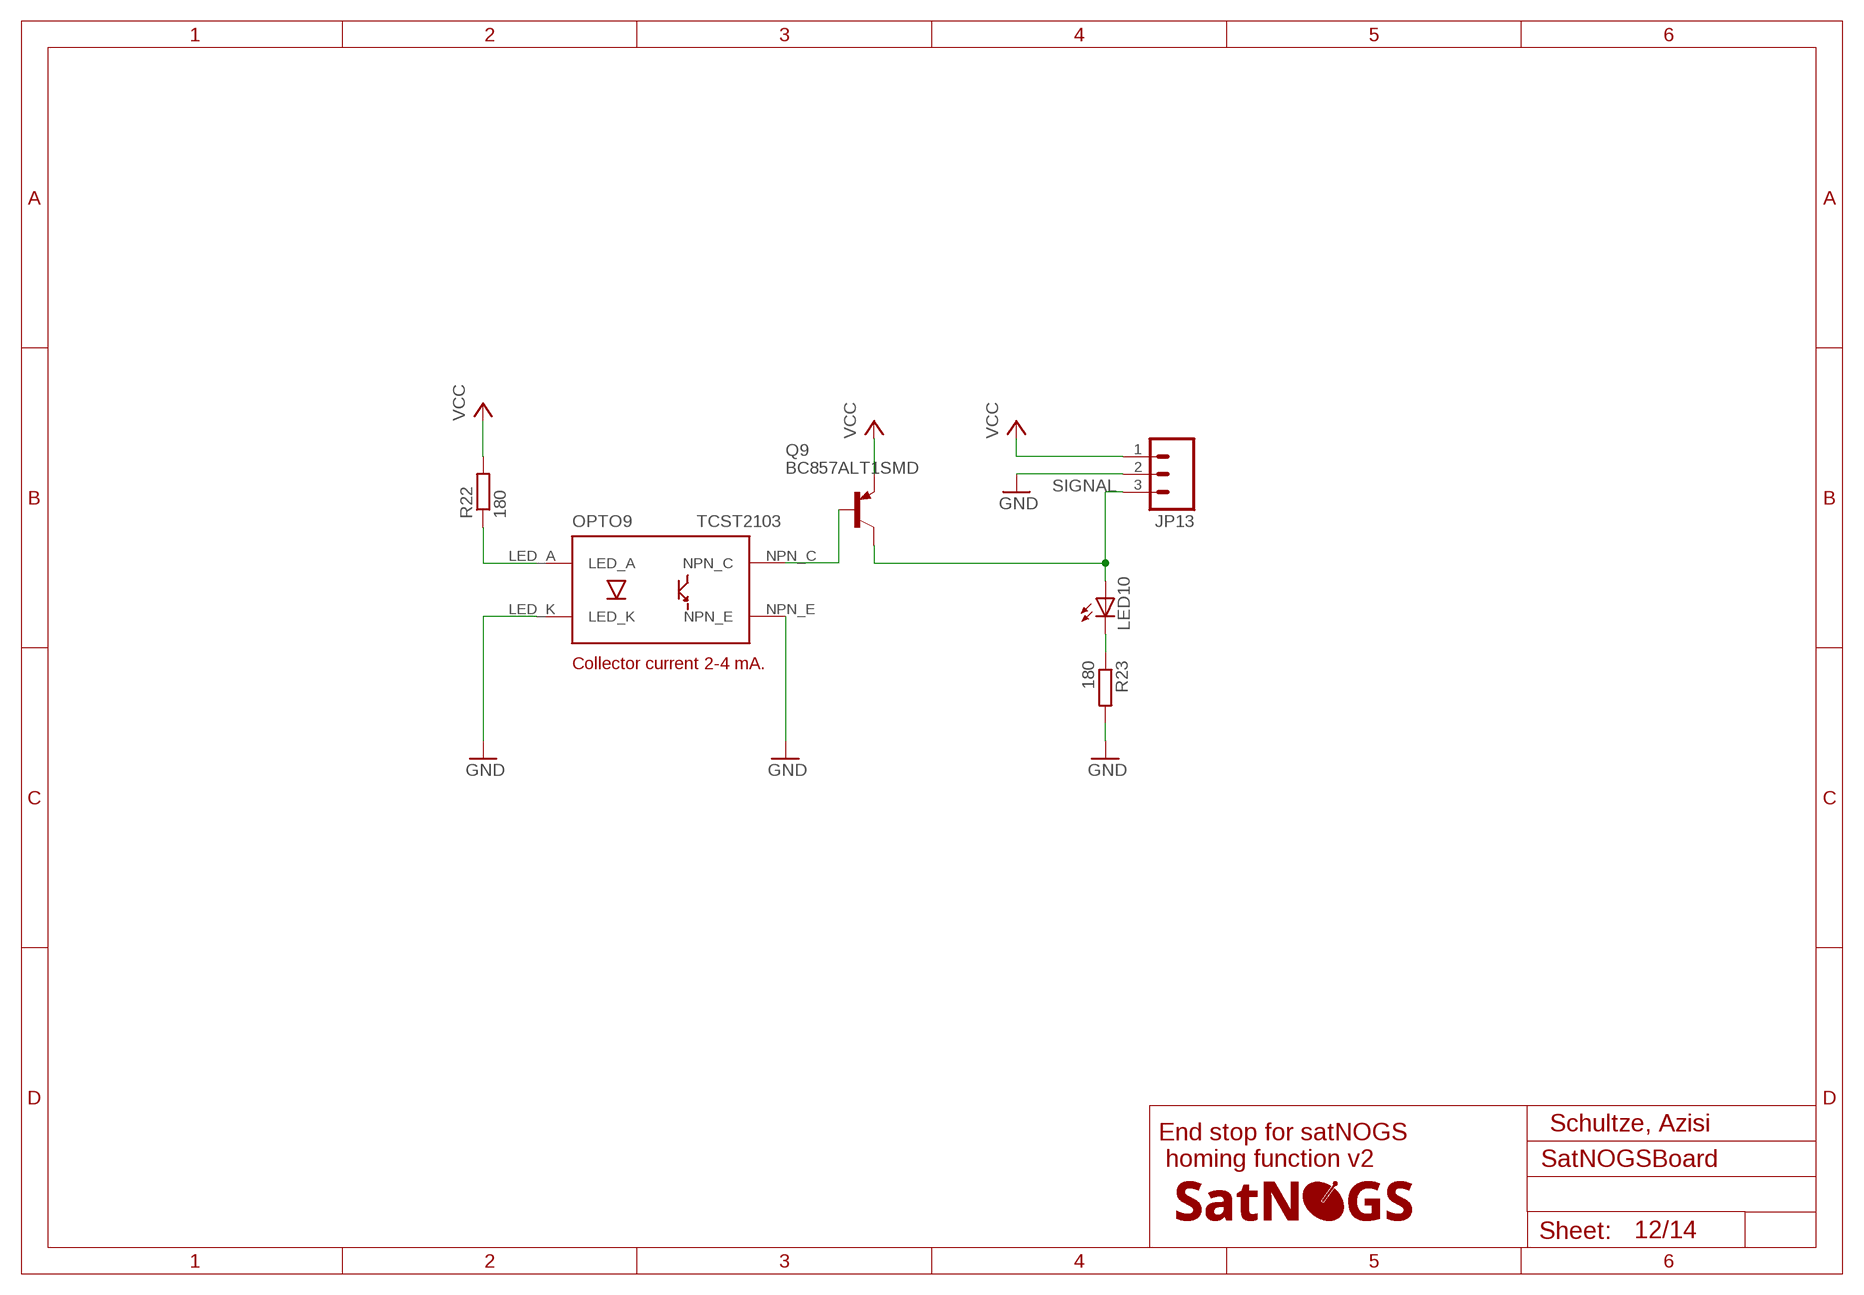
[diagram p11: schematic, sheet 12]

### Parts
JP13  M03PTH  [1X03]
LED10  LED3MM  [LED3MM]
LOGO9  SATNOGS_LOGOSILK_XS  [LOGO_SILK_XS]
OPTO9  TCST2103  [TCST2013]
Q9  BC857ALT1SMD  [SOT23-BEC]
R22  180  R-EU_R0805  [R0805]
R23  180  R-EU_R0805  [R0805]

### Nets
GND: JP13.2 OPTO9.LED_K R23.2 ; also sheet 1,2,3,4,5,6,7,8,9,10,11,13,14
N$33: OPTO9.LED_A R22.1
N$34: LED10.K(C) R23.1
N$35: OPTO9.NPN_C Q9.B
SIGNAL: JP13.3 LED10.A Q9.C ; also sheet 2,3,4,5,10,11,13,14
VCC [power]: JP13.1 Q9.E R22.2 ; also sheet 1,2,3,4,5,9,10,11,13,14
Unconnected: OPTO9.NPN_E

### Notes on the sheet
- Collector current 2-4 mA.
- Schultze, Azisi
- End stop for satNOGS
   homing function v2

## Sheet 13 of 14
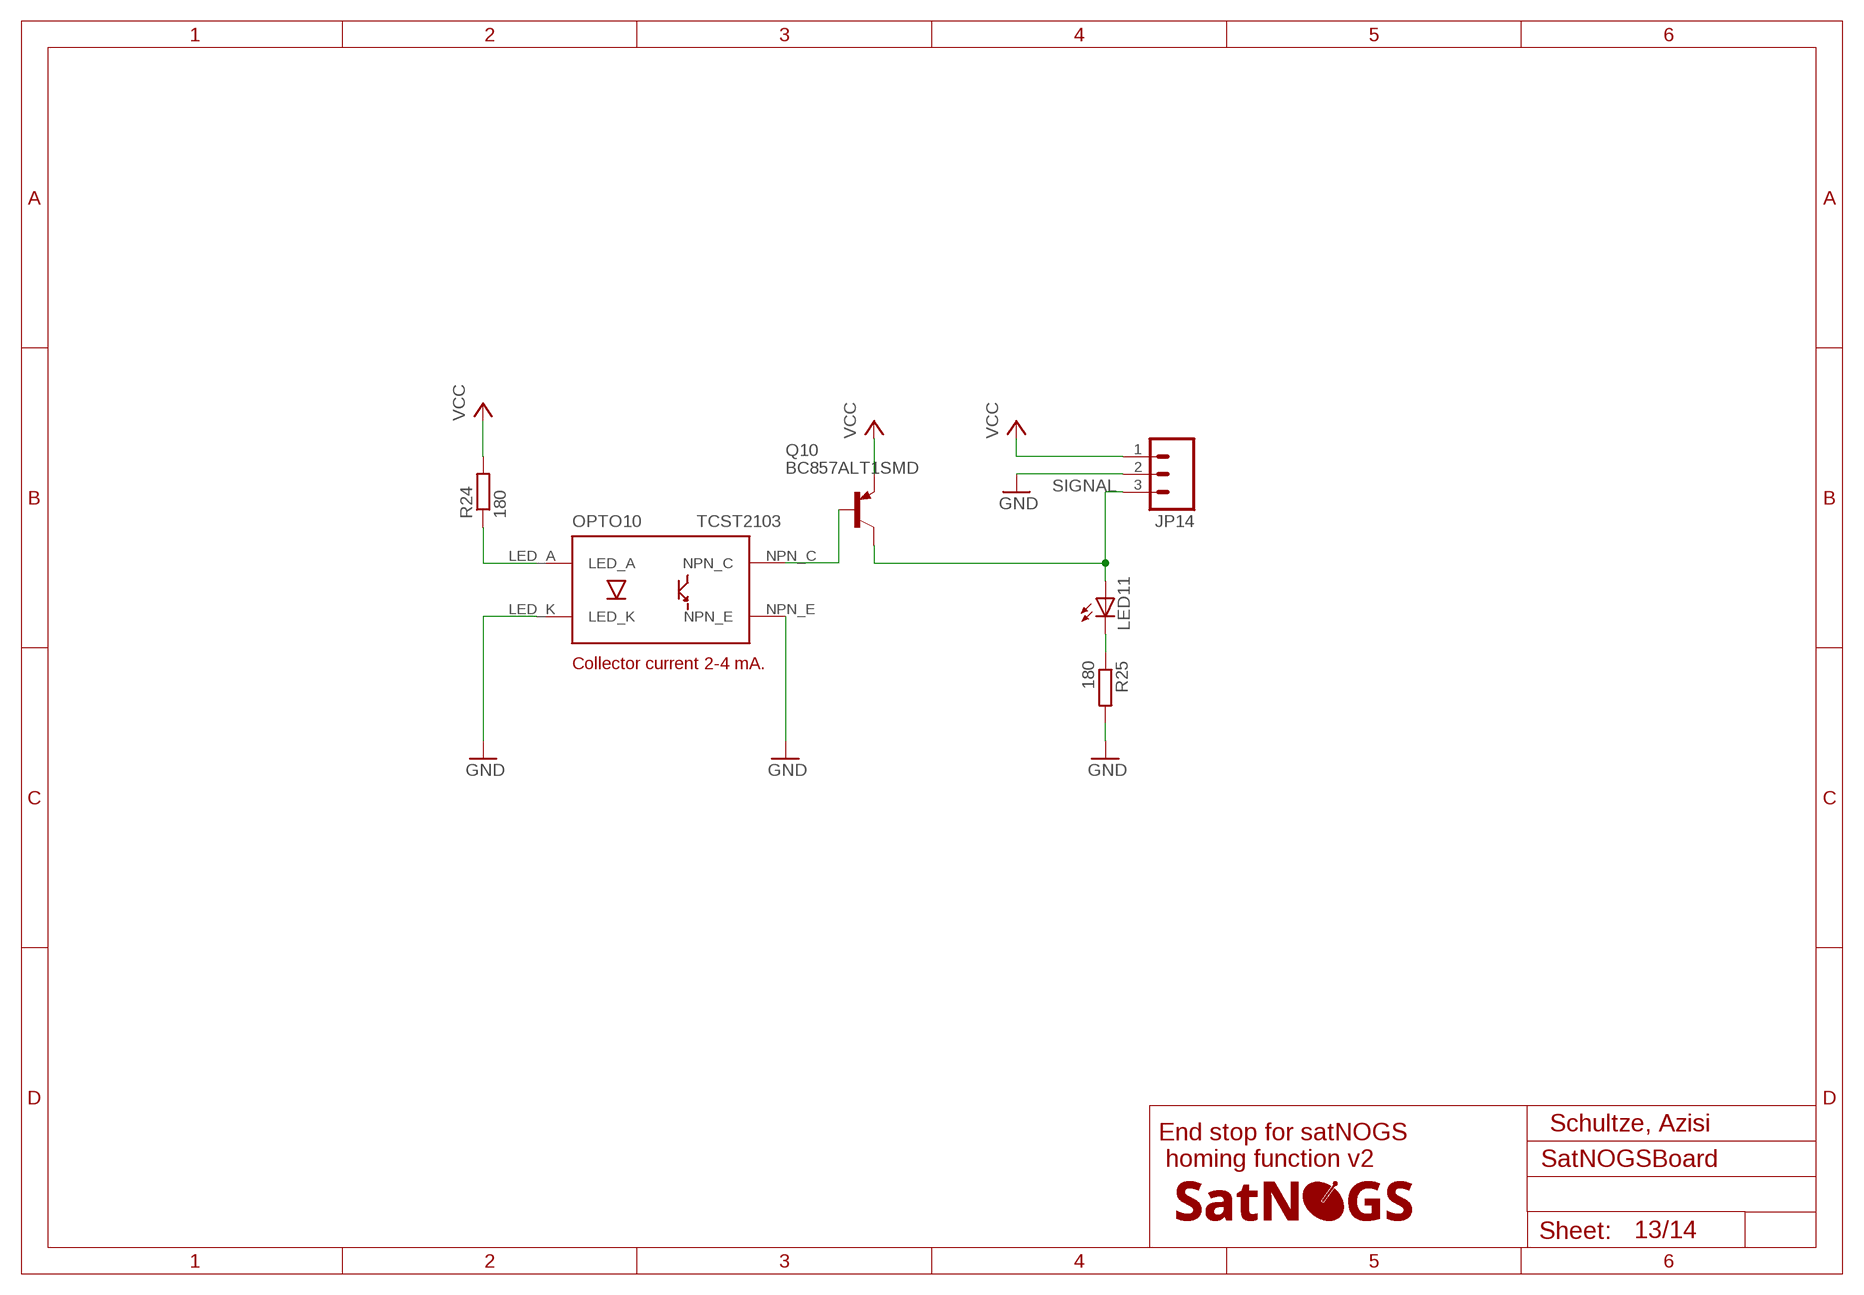
[diagram p12: schematic, sheet 13]

### Parts
JP14  M03PTH  [1X03]
LED11  LED3MM  [LED3MM]
LOGO10  SATNOGS_LOGOSILK_XS  [LOGO_SILK_XS]
OPTO10  TCST2103  [TCST2013]
Q10  BC857ALT1SMD  [SOT23-BEC]
R24  180  R-EU_R0805  [R0805]
R25  180  R-EU_R0805  [R0805]

### Nets
GND: JP14.2 OPTO10.LED_K R25.2 ; also sheet 1,2,3,4,5,6,7,8,9,10,11,12,14
N$36: OPTO10.LED_A R24.1
N$37: LED11.K(C) R25.1
N$38: OPTO10.NPN_C Q10.B
SIGNAL: JP14.3 LED11.A Q10.C ; also sheet 2,3,4,5,10,11,12,14
VCC [power]: JP14.1 Q10.E R24.2 ; also sheet 1,2,3,4,5,9,10,11,12,14
Unconnected: OPTO10.NPN_E

### Notes on the sheet
- Collector current 2-4 mA.
- Schultze, Azisi
- End stop for satNOGS
   homing function v2

## Sheet 14 of 14
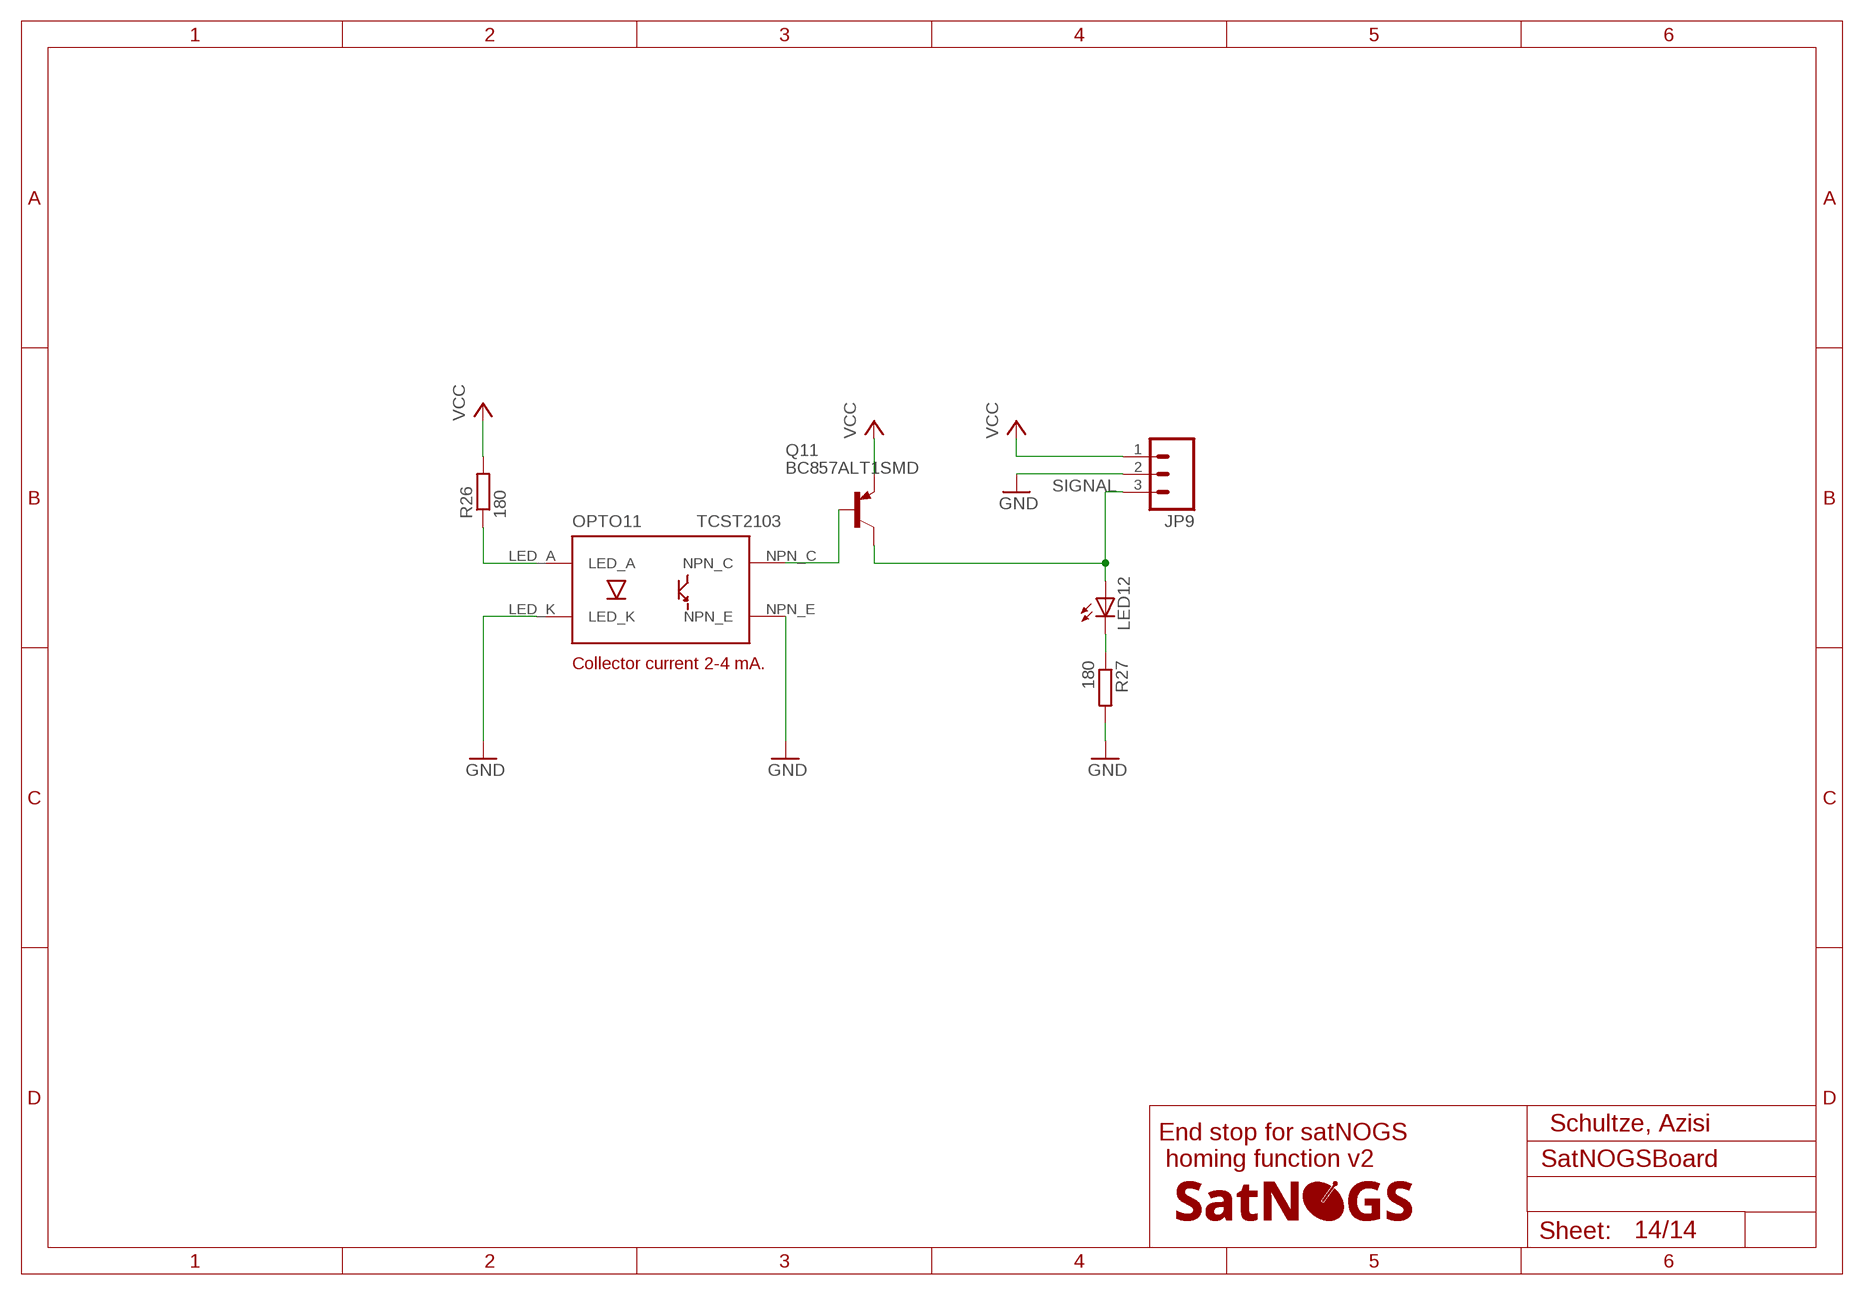
[diagram p13: schematic, sheet 14]

### Parts
JP9  M03PTH  [1X03]
LED12  LED3MM  [LED3MM]
LOGO11  SATNOGS_LOGOSILK_XS  [LOGO_SILK_XS]
OPTO11  TCST2103  [TCST2013]
Q11  BC857ALT1SMD  [SOT23-BEC]
R26  180  R-EU_R0805  [R0805]
R27  180  R-EU_R0805  [R0805]

### Nets
GND: JP9.2 OPTO11.LED_K R27.2 ; also sheet 1,2,3,4,5,6,7,8,9,10,11,12,13
N$20: OPTO11.LED_A R26.1
N$39: LED12.K(C) R27.1
N$40: OPTO11.NPN_C Q11.B
SIGNAL: JP9.3 LED12.A Q11.C ; also sheet 2,3,4,5,10,11,12,13
VCC [power]: JP9.1 Q11.E R26.2 ; also sheet 1,2,3,4,5,9,10,11,12,13
Unconnected: OPTO11.NPN_E

### Notes on the sheet
- Collector current 2-4 mA.
- Schultze, Azisi
- End stop for satNOGS
   homing function v2

## Library data of the parts
A0$1-A0$3 = jumper:SJ2W: SMD solder JUMPER
B1 = satnogs:LM2596-BREAKOUT: Break out for LM2596 Switching power supply (regulated) Footprint approx. 41mmx21mm
B2 = satnogs:ARDUINO_PRO_MICRO
B3 B4 = satnogs:POLOLU-A4983/A4988: Stepper motor driver https://www.pololu.com/product/1182
C1-C4 = rcl:CPOL-EU: POLARIZED CAPACITOR, European symbol
C5-C7 = rcl:C-EU: CAPACITOR, European symbol
D1 = diode:ZENER-DIODE: Z-Diode; MPN: 1N5339B
H1 = holes:MOUNT-PAD-ROUND: MOUNTING PAD, round
J1 J3-J5 = Connector:HEADER-2P
J2 = Connector:HEADER-2X3P
JP1 = pinhead:PINHD-1X8: PIN HEADER
JP2-JP5 JP9 JP11-JP14 = SparkFun-Connectors:M03: Header 3 Standard 3-pin 0.1" header. Use with straight break away headers (SKU : PRT-00116), right angle break away headers (PRT-00553), swiss pins (PRT-00743), machine pins (PRT-00117), and female headers (PRT-00115). Molex polarized connector foot print use with SKU : PRT-08232 with associated crimp pins and housings.
JP6-JP8 JP10 = pinhead:PINHD-1X4: PIN HEADER
LED1-LED12 = led:LED: LED OSRAM: - CHIPLED LG R971, LG N971, LY N971, LG Q971, LY Q971, LO R971, LY R971 LH N974, LH R974 LS Q976, LO Q976, LY Q976 LO Q996 - Hyper CHIPLED LW Q18S LB Q993, LB Q99A, LB R99A - SideLED LS A670, LO A670, LY A670, LG A670, LP A670 LB A673, LV A673, LT A673, LW A673 LH A674 LY A675 LS A676, LA A676, LO A676, LY A676, LW A676 LS A679, LY A679, LG A679 - Hyper Micro SIDELED® LS Y876, LA Y876, LO Y876, LY Y876 LT Y87S - SmartLED LW L88C, LW L88S LB L89C, LB L89S, LG L890 LS L89K, LO L89K, LY L89K LS L896, LA L896, LO L896, LY L896 - TOPLED LS T670, LO T670, LY T670, LG T670, LP T670 LSG T670, LSP T670, LSY T670, LOP T670, LYG T670 LG T671, LOG T671, LSG T671 LB T673, LV T673, LT T673, LW T673 LH T674 LS T676, LA T676, LO T676, LY T676, LB T676, LH T676, LSB T676, LW T676 LB T67C, LV T67C, LT T67C, LS T67K, LO T67K, LY T67K, LW E67C LS E67B, LA E67B, LO E67B, LY E67B, LB E67C, LV E67C, LT E67C LW T67C LS T679, LY T679, LG T679 LS T770, LO T770, LY T770, LG T770, LP T770 LB T773, LV T773, LT T773, LW T773 LH T774 LS E675, LA E675, LY E675, LS T675 LS T776, LA T776, LO T776, LY T776, LB T776 LHGB T686 LT T68C, LB T68C - Hyper Mini TOPLED® LB M676 - Mini TOPLED Santana® LG M470 LS M47K, LO M47K, LY M47K Source: http://www.osram.convergy.de LUXEON: - LUMILED® LXK2-PW12-R00, LXK2-PW12-S00, LXK2-PW14-U00, LXK2-PW14-V00 LXK2-PM12-R00, LXK2-PM12-S00, LXK2-PM14-U00 LXK2-PE12-Q00, LXK2-PE12-R00, LXK2-PE12-S00, LXK2-PE14-T00, LXK2-PE14-U00 LXK2-PB12-K00, LXK2-PB12-L00, LXK2-PB12-M00, LXK2-PB14-N00, LXK2-PB14-P00, LXK2-PB14-Q00 LXK2-PR12-L00, LXK2-PR12-M00, LXK2-PR14-Q00, LXK2-PR14-R00 LXK2-PD12-Q00, LXK2-PD12-R00, LXK2-PD12-S00 LXK2-PH12-R00, LXK2-PH12-S00 LXK2-PL12-P00, LXK2-PL12-Q00, LXK2-PL12-R00 Source: www.luxeon.com KINGBRIGHT: KA-3528ASYC Source: www.kingbright.com
LOGO1-LOGO11 = satnogs:SATNOGS_LOGO
OPTO1-OPTO11 = satnogs:TCST2103
Q1-Q11 = transistor-pnp:BC857*: PNP Transistror
R1-R27 = rcl:R-EU_: RESISTOR, European symbol
SJ1-SJ8 = jumper:SJ: SMD solder JUMPER
T1 T2 = satnogs:DISCHARGE_TUBE_2PIN: 2027 Series - 2-Pole Gas Discharge Tube Surge current 25kA Author: Alexander Schultze (03/15); MF: BOURNS; MPN: 2027-09-CLF; OC_FARNELL: 2383324
U1-U3 = NXP_By_element14_Batch_1:LM75BD: Digital temperature sensor and thermal watchdog; MPN: LM75BD; OC_FARNELL: 1854077; OC_NEWARK: 39T1312; PACKAGE: SO-8; SUPPLIER: NXP
X1 = con-cypressindustries:USB_3PSHIELD-: Triple USB Connector Source: www.cypressindustries.com; OC_FARNELL: unknown; OC_NEWARK: unknown
X2-X4 = con-ptr500:AK500/2: CONNECTOR; OC_FARNELL: unknown; OC_NEWARK: unknown
X5 X6 = con-ptr500:AK500/4: CONNECTOR; OC_FARNELL: unknown; OC_NEWARK: unknown

## Net classes
0 default: width 0.203 mm, drill 0.813 mm, clearance 0.254 mm
1 power: width 0.406 mm, drill 0.813 mm, clearance 0.254 mm

## Board
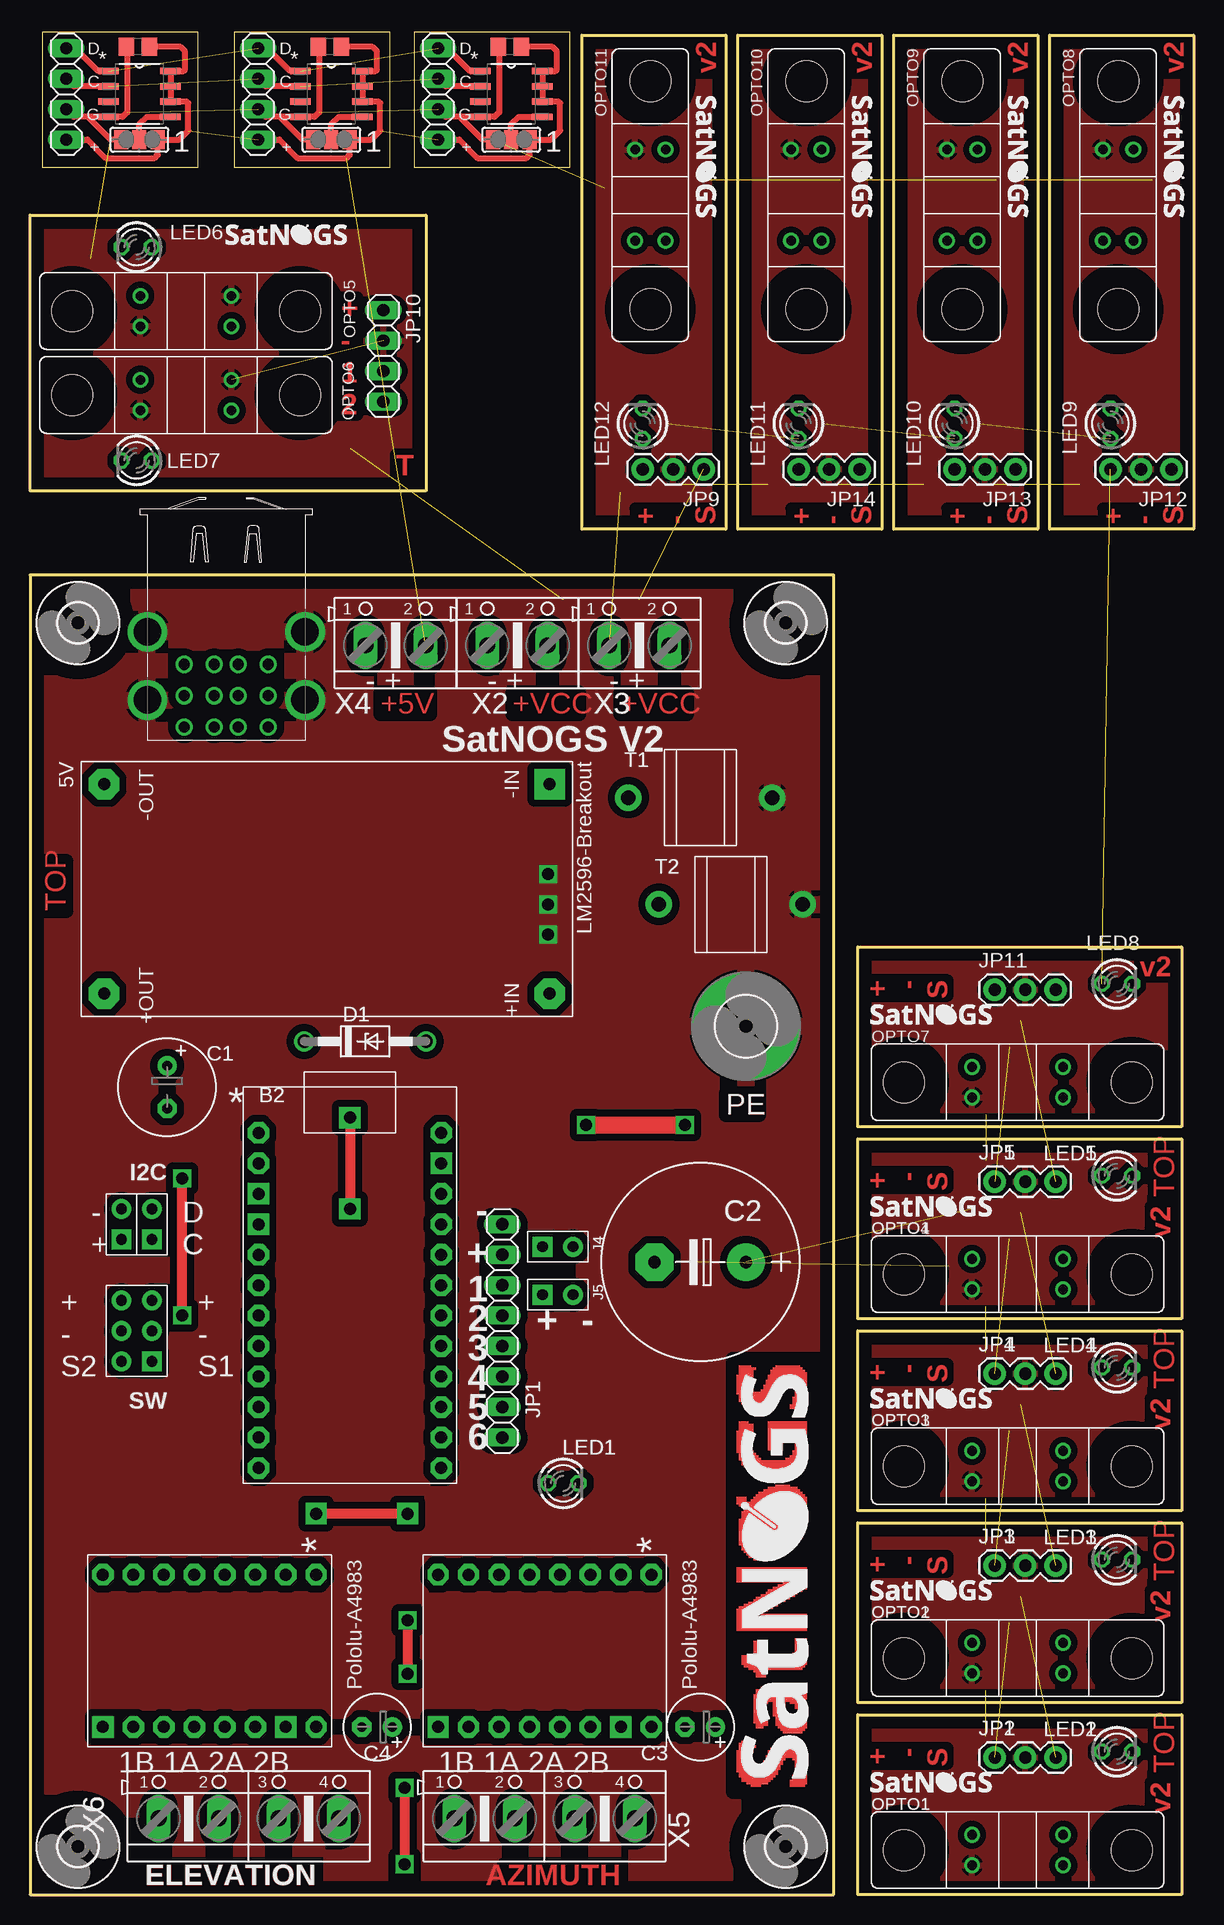
[diagram p14: board, top side]
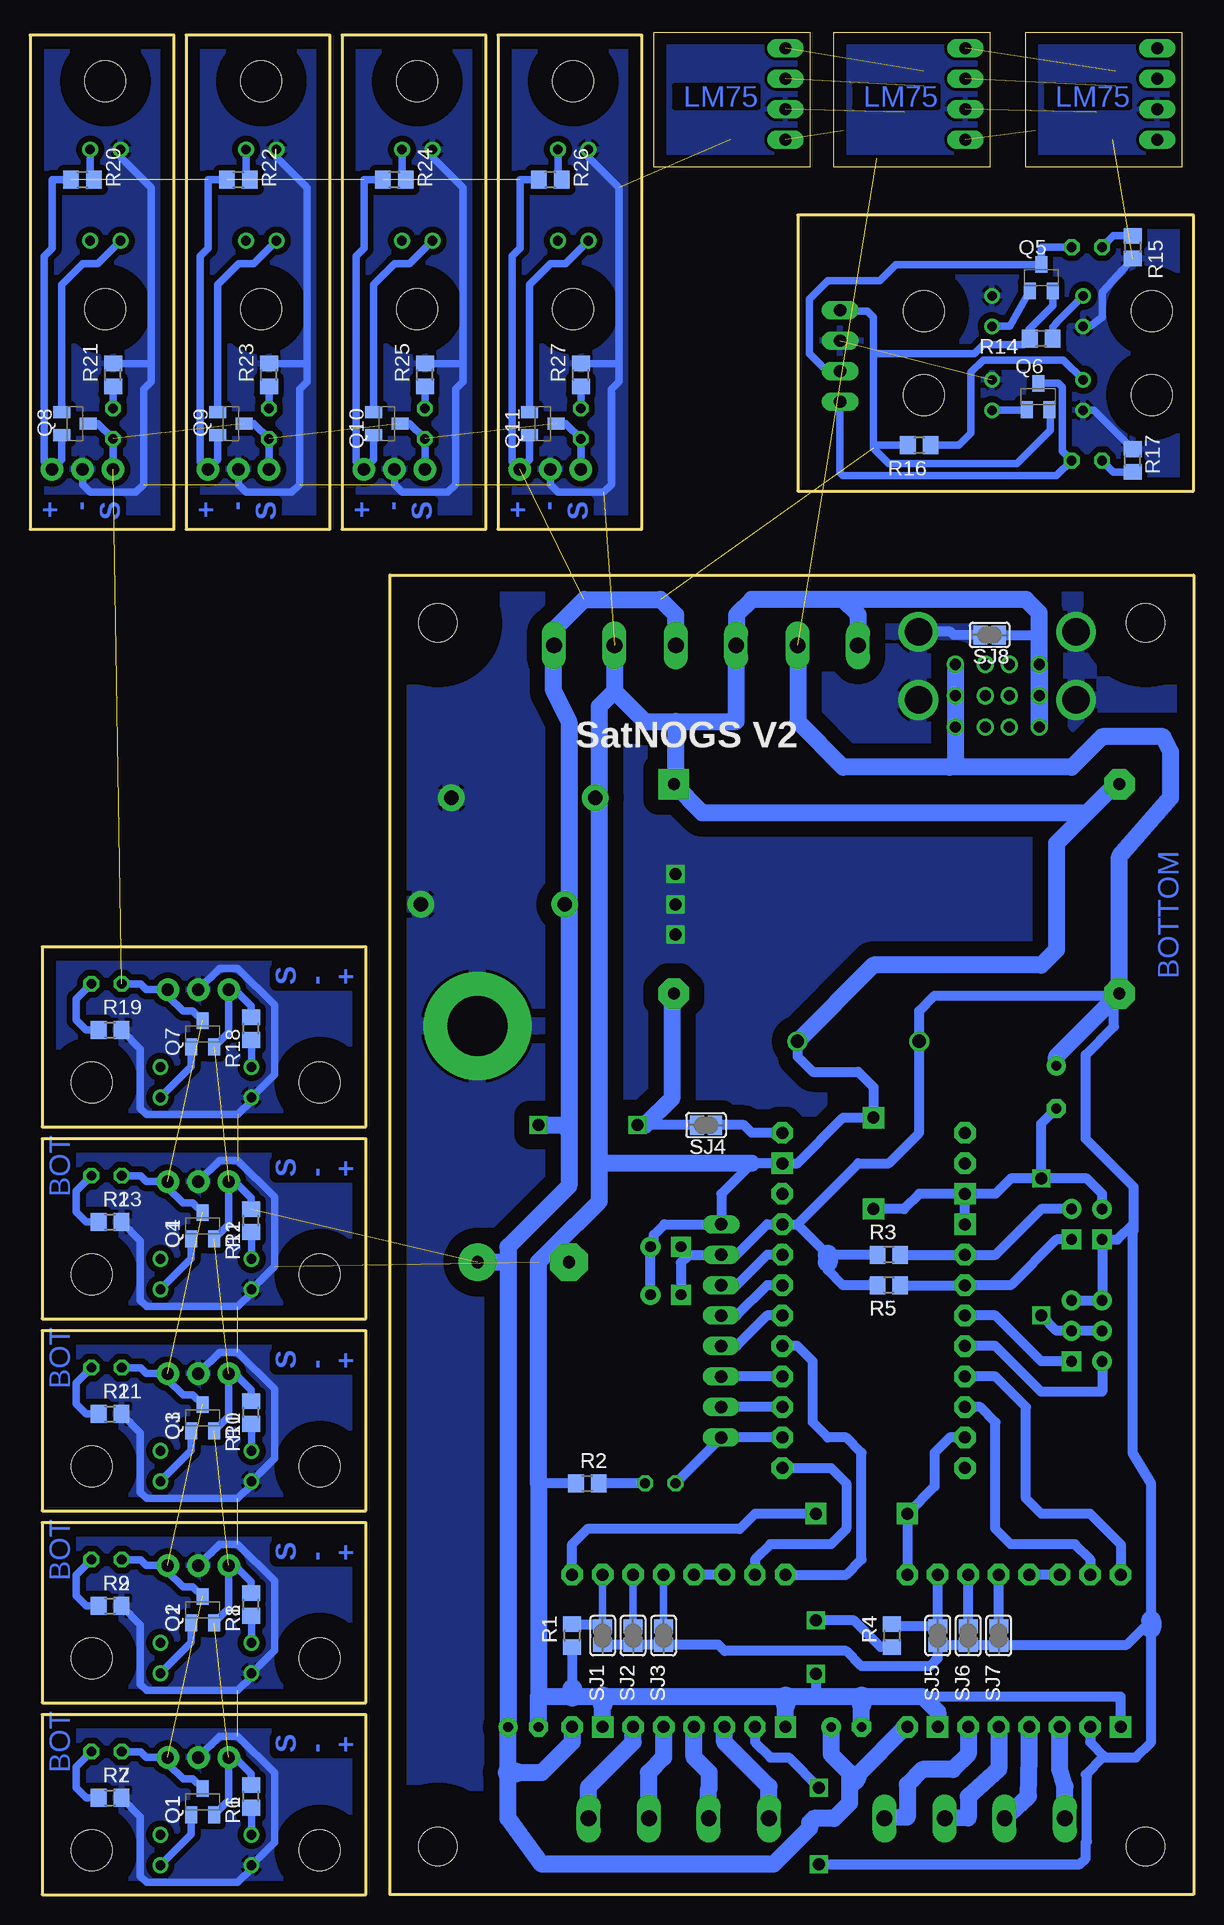
[diagram p15: board, bottom side, seen from below]

Size 97 x 155.25 mm. Coordinates in mm from the lower left corner, seen from the top.
Outline: 0,0 67,0 67,110 0,110 0,0
Outline: 69,0 69,15 96,15 96,0 69,0
Outline: 69,16 69,31 96,31 96,16 69,16
Outline: 69,32 69,47 96,47 96,32 69,32
Outline: 69,48 69,63 96,63 96,48 69,48
Outline: 1,144 14,144 14,155.25 1,155.25 1,144
Outline: 17,144 30,144 30,155.25 17,155.25 17,144
Outline: 32,144 45,144 45,155.25 32,155.25 32,144
Outline: 0,117 0,140 33,140 33,117 0,117
Outline: 69,64 69,79 96,79 96,64 69,64
Outline: 85,155 97,155 97,113.81 85,113.81 85,155
Outline: 72,155 84,155 84,113.81 72,113.81 72,155
Outline: 59,155 71,155 71,113.81 59,113.81 59,155
Outline: 46,155 58,155 58,113.81 46,113.81 46,155
Copper layers (1*16): Top 0.035mm / dielectric 1.5mm / Bottom 0.035mm
Design rules "platinenbelichter *": minimum track width 8mil, minimum drill 24mil, track to track 10mil, track to pad 10mil, pad to pad 10mil, via to via 10mil, smd to smd 10mil, copper to edge 40mil, drill to drill 8mil, minimum pad ring 10mil, minimum via ring 8mil, stop-mask expansion 10mil, vias tented up to drill 0mil, thermal gap 10mil

### Footprints (pad centres in the part's own frame; a part is rotated, then mirrored left to right if it is on the bottom)
SJ_2 = smd 1.168 x 1.6: 1 -1.524,0; 2 0,0; 3 1.524,0
LM2596-BREAKOUT = drill 1 pad 2.54 square: 1 -8.89,17.78 | drill 1 pad 2.54 octagon: 2 -8.89,-19.367; 3 8.572,-19.367; 4 8.572,17.78
ARDUINO_MICRO_PRO = drill 1 pad 1.778 octagon: 1 -7.62,12.7; 2 -7.62,10.16; 5 -7.62,2.54; 6 -7.62,0; 7 -7.62,-2.54; 8 -7.62,-5.08; 9 -7.62,-7.62; 10 -7.62,-10.16; 11 -7.62,-12.7; 12 -7.62,-15.24; 13 7.62,-15.24; 14 7.62,-12.7; 15 7.62,-10.16; 16 7.62,-7.62; 17 7.62,-5.08; 18 7.62,-2.54; 19 7.62,0; 20 7.62,2.54; 21 7.62,5.08; 22 7.62,7.62; 24 7.62,12.7 | drill 1 pad 1.778 square: 3 -7.62,7.62; 4 -7.62,5.08; 23 7.62,10.16
POLOLU-A4983 = drill 1 pad 1.778 octagon: 1 -6.35,8.89; 2 -6.35,6.35; 3 -6.35,3.81; 4 -6.35,1.27; 5 -6.35,-1.27; 6 -6.35,-3.81; 7 -6.35,-6.35; 8 -6.35,-8.89; 10 6.35,-6.35; 11 6.35,-3.81; 12 6.35,-1.27; 13 6.35,1.27; 14 6.35,3.81; 16 6.35,8.89 | drill 1 pad 1.778 square: 9 6.35,-8.89; 15 6.35,6.35
E3,5-8 = drill 0.813 pad 1.6: + -1.778,0 | drill 0.813 pad 1.6 octagon: - 1.778,0
E7,5-16 = drill 1.016 pad 3.15: + -3.81,0 | drill 1.016 pad 3.15 octagon: - 3.81,0
E2,5-6 = drill 0.813 pad 1.6: + -1.27,0 | drill 0.813 pad 1.6 octagon: - 1.27,0
C0805 = smd 1.3 x 1.5: 1 -0.95,0; 2 0.95,0
DO41Z10 = drill 1.118: A 5.08,0; C -5.08,0
5,0-PAD = drill 5 pad 9: B5 0,0
2P-2.54-65/35MIL = drill 0.889 pad 1.651 square: 1 0,1.27 | drill 0.889 pad 1.651: 2 0,-1.27
2X3P-2.54-65/35MIL = drill 0.889 pad 1.651 square: 1 -1.27,2.54 | drill 0.889 pad 1.651: 2 -1.27,0; 3 -1.27,-2.54; 4 1.27,-2.54; 5 1.27,0; 6 1.27,2.54
1X08 = drill 1.016 long: 1 -8.89,0; 2 -6.35,0; 3 -3.81,0; 4 -1.27,0; 5 1.27,0; 6 3.81,0; 7 6.35,0; 8 8.89,0
1X03 = drill 1.016 pad 1.88: 1 0,0; 2 2.54,0; 3 5.08,0
1X04 = drill 1.016 long: 1 -3.81,0; 2 -1.27,0; 3 1.27,0; 4 3.81,0
LED3MM = drill 0.813 octagon: A -1.27,0; K 1.27,0
TCST2013 = drill 0.8: LED_A -3.8,1.27; LED_K -3.8,-1.27; NPN_C 3.8,-1.27; NPN_E 3.8,1.27 | hole 3.4: -9.5,0; 9.5,0
SOT23-BEC = smd 1 x 1.4: B -0.95,-1.1; C 0,1.1; E 0.95,-1.1
R0805 = smd 1.3 x 1.5: 1 -0.95,0; 2 0.95,0
SJ = smd 1.168 x 1.6: 1 -0.762,0; 2 0.762,0
DISCHARGE_2WIRE = drill 1.2 pad 2.2: P$1 -6,0; P$2 6,0
SOIC127P600X175-8N = smd 1.702 x 0.533: 1 -2.591,1.905; 2 -2.591,0.635; 3 -2.591,-0.635; 4 -2.591,-1.905; 5 2.591,-1.905; 6 2.591,-0.635; 7 2.591,0.635; 8 2.591,1.905
3,2 = hole 3.2: 0,0
85-32003-00X-1 = drill 0.92 pad 1.27: 1-1 2.71,3.5; 1-2 2.71,1; 1-3 2.71,-1; 1-4 2.71,-3.5; 2-1 5.33,3.5; 2-2 5.33,1; 2-3 5.33,-1; 2-4 5.33,-3.5; 3-1 7.95,3.5; 3-2 7.95,1; 3-3 7.95,-1; 3-4 7.95,-3.5 | drill 2.3 pad 3: M1 0,6.57; M2 0,-6.57; M3 5.68,6.57; M4 5.68,-6.57
AK500/2 = drill 1.321 long: 1 -2.515,0; 2 2.515,0
AK500/4 = drill 1.321 long: 1 -7.518,0; 2 -2.489,0; 3 2.489,0; 4 7.518,0

### Placement (x,y rotation side)
A0$1  9.12,146.28 0 top
A0$2  25.12,146.28 0 top
A0$3  40.12,146.28 0 top
B1  25.55,83.67 270 top
B2  26.67,50.8 0 top
B3  42.91,20.32 270 top
B4  14.97,20.32 270 top
C1  11.43,67.31 270 top
C2  55.88,52.72 180 top
C3  55.88,13.97 180 top
C4  28.94,13.97 180 top
C5  9,154.03 180 top
C6  25,154.03 180 top
C7  40,154.03 180 top
D1  27.94,71.12 0 top
H1  59.69,72.39 0 top
J1  10.16,55.88 180 top
J2  8.89,46.99 180 top
J3  7.62,55.88 180 top
J4  44,54 90 top
J5  44,50 90 top
JP1  39.37,46.99 90 top
JP2  80.43,11.43 0 top
JP3  80.43,27.43 0 top
JP4  80.43,43.43 0 top
JP5  80.43,59.43 0 top
JP6  3.03,150.09 90 top
JP7  19.03,150.09 90 top
JP8  34.03,150.09 90 top
JP9  56.16,118.81 180 top
JP10  29.46,128.26 270 top
JP11  80.43,75.43 0 top
JP12  95.16,118.81 180 top
JP13  82.16,118.81 180 top
JP14  69.16,118.81 180 top
LED1  44.45,34.29 0 top
LED2  90.61,11.92 0 top
LED3  90.61,27.92 0 top
LED4  90.61,43.92 0 top
LED5  90.61,59.92 0 top
LED6  8.89,137.32 180 top
LED7  8.89,119.54 180 top
LED8  90.61,75.92 0 top
LED9  90.08,122.61 90 top
LED10  77.08,122.61 90 top
LED11  64.08,122.61 90 top
LED12  51.08,122.61 90 top
LOGO1  64.89,9.71 90 top
LOGO2  70.08,8.53 0 top
LOGO3  70.08,24.52 0 top
LOGO4  70.08,40.52 0 top
LOGO5  70.08,56.52 0 top
LOGO6  16.32,137.53 0 top
LOGO7  70.08,72.53 0 top
LOGO8  94.53,149.92 270 top
LOGO9  81.53,149.92 270 top
LOGO10  68.53,149.92 270 top
LOGO11  55.52,149.92 270 top
OPTO1  82.33,3.71 0 top
OPTO2  82.33,19.71 0 top
OPTO3  82.33,35.72 0 top
OPTO4  82.33,51.72 0 top
OPTO5  13,132 0 top
OPTO6  13,125 0 top
OPTO7  82.33,67.72 0 top
OPTO8  90.72,141.66 270 top
OPTO9  77.72,141.66 270 top
OPTO10  64.72,141.66 270 top
OPTO11  51.72,141.66 270 top
Q1  82.61,7.74 0 bottom
Q2  82.61,23.75 0 bottom
Q3  82.61,39.74 0 bottom
Q4  82.61,55.74 0 bottom
Q5  12.7,134.78 0 bottom
Q6  12.95,124.87 0 bottom
Q7  82.61,71.75 0 bottom
Q8  93.25,122.61 270 bottom
Q9  80.25,122.61 270 bottom
Q10  67.25,122.61 270 bottom
Q11  54.26,122.61 270 bottom
R1  51.8,21.59 90 bottom
R2  50.53,34.29 0 bottom
R3  25.4,53.34 180 bottom
R4  25.13,21.59 90 bottom
R5  25.4,50.8 180 bottom
R6  78.57,8.19 90 bottom
R7  90.32,8.08 0 bottom
R8  78.57,24.19 90 bottom
R9  90.32,24.08 0 bottom
R10  78.57,40.19 90 bottom
R11  90.32,40.08 0 bottom
R12  78.57,56.19 90 bottom
R13  90.32,56.08 0 bottom
R14  12.7,129.7 180 bottom
R15  5.08,137.32 270 bottom
R16  22.86,120.81 180 bottom
R17  5.08,119.54 90 bottom
R18  78.57,72.19 90 bottom
R19  90.32,72.08 0 bottom
R20  92.62,142.94 180 bottom
R21  90.08,126.68 90 bottom
R22  79.62,142.94 180 bottom
R23  77.08,126.68 90 bottom
R24  66.62,142.94 180 bottom
R25  64.08,126.68 90 bottom
R26  53.62,142.94 180 bottom
R27  51.08,126.68 90 bottom
SJ1  49.26,21.59 90 bottom
SJ2  46.72,21.59 90 bottom
SJ3  44.18,21.59 90 bottom
SJ4  40.64,64.14 180 bottom
SJ5  21.32,21.59 90 bottom
SJ6  18.78,21.59 90 bottom
SJ7  16.24,21.59 90 bottom
SJ8  17,105 180 bottom
T1  55.88,91.44 0 top
T2  58.42,82.55 0 top
U1  9.12,150.09 0 top
U2  25.12,150.09 0 top
U3  40.12,150.09 0 top
U$1  [3,2]  63,106 0 top
U$2  SATNOGS_LOGOCOPPER_M  [LOGO_COPPER_M@1]  64.69,9.08 90 top
U$3  [3,2]  4,106 0 top
U$5  [3,2]  63,4 0 top
U$6  [3,2]  4,4 0 top
X1  16.36,105.26 270 top
X2  40.64,104.14 0 top
X3  50.8,104.14 0 top
X4  30.48,104.14 0 top
X5  42.91,6.35 0 top
X6  18.24,6.35 0 top

### Tracks (layer width: path | path; a pad name or v marks a point on that pad's centre or on a via)
1-1A
  Bottom 1.422: X5.2 40.42,8.84 40.37,8.89 40.37,10.16 41.64,11.43 B3.12
1-1B
  Bottom 1.422: X5.1 35.39,8.99 39.1,12.7 B3.11
1-2A
  Bottom 1.422: B3.13 44.18,11.43 45.45,10.16 45.45,6.4 X5.3
1-2B
  Bottom 1.422: X5.4 50.43,8.99 46.72,12.7 B3.14
2-1A
  Bottom 1.422: X6.2 13.75,8.21 13.7,11.43 B4.12
2-1B
  Bottom 1.422: X6.1 10.72,8.99 11.16,10.43 B4.11
2-2A
  Bottom 1.422: B4.13 16.24,10.43 18.78,8.16 18.78,6.4 X6.3
2-2B
  Bottom 1.422: X6.4 23.86,6.45 23.86,9.16 22.59,10.43 20.05,10.43 18.78,11.7 B4.14
+5V  (via drill 1)  (3 unrouted)
  Top 0.508: JP6.1 4.81,146.28 6.33,144.76 10.39,144.76 10.65,145.01 A0$1.3 12.43,146.28 13.19,147.04 13.19,149.33 13.06,149.46 U1.6 U1.7 U1.8 12.81,152 12.93,152.12 12.93,153.65 12.55,154.03 C5.1 | JP7.1 20.81,146.28 22.33,144.76 26.39,144.76 26.65,145.01 A0$2.3 28.43,146.28 29.19,147.04 29.19,149.33 29.06,149.46 U2.6 U2.7 U2.8 28.81,152 28.93,152.12 28.93,153.65 28.55,154.03 C6.1 | JP8.1 35.81,146.28 37.33,144.76 41.39,144.76 41.65,145.01 A0$3.3 43.43,146.28 44.19,147.04 44.19,149.33 44.06,149.46 U3.6 U3.7 U3.8 43.81,152 43.93,152.12 43.93,153.65 43.55,154.03 C7.1
  Top 0.813: v31.21,8.89 v31.21,2.54
  Bottom 0.813: SJ1.1 SJ2.1 SJ3.1 39.61,20.83 39.1,20.32 28.94,20.32 27.67,19.05 21.95,19.05 21.32,19.68 SJ5.1 SJ6.1 SJ7.1 5.57,20.83 3.54,22.86 3.54,34.29 5.08,36.83 5.08,55.24 5,55.33 5,55.96 | J2.3 J2.4 J3.1 6.35,54.61 5,55.96 | B4.10 8.62,12.7 7.46,11.54 | 7.46,11.54 7.35,11.43 4.81,11.43 3.54,12.7 3.54,22.23 | B3.10 36.56,12.7 35.29,11.43 33.75,11.43 v31.21,8.89 | v31.21,2.54 9.46,2.54 9,3 9,4.33 8.89,4.45 8.89,9.89 9,10 7.46,11.54 | R3.2 30.48,53.34 33.02,55.88 | 30.48,52.7 30.48,52.07 29.21,50.8 R5.2 26.67,51.12 | 33.02,55.88 B2.21 35.56,55.88 38.1,53.34 JP1.7 42.07,53.34 | 33.02,55.88 27.94,60.96 25.4,60.96 22.86,63.5 D1.C 22.86,73.66 21.59,74.93 6.35,74.93 B1.3 | J4.1 42.07,53.34 | 42.07,53.34 42.73,52.68 J5.1 | 5,55.96 5,59 9,63 9,70 6.64,72.36 6.64,74.64
  Bottom 1.422: X1.1-1 X1.2-1 X1.3-1 19.86,94.44 20.32,93.98 | X4.2 32.99,97.77 29.21,93.98 20.32,93.98 | C1.+ 11.43,69.85 6.64,74.64 B1.3 6.18,86.53 1.9,91.44 1.9,95.25 2.54,96.52 7.62,96.52 10.16,93.98 20.32,93.98
  Bottom 1.676: 30.48,53.34 30.48,52.7 | 3.54,22.86 3.54,22.23
DIR-1
  Bottom 0.813: B3.8 28.94,26.67 27.67,27.94 27.67,36.83 28.94,38.1 30.48,38.1 31.75,39.37 31.75,44.45 33.02,45.72 B2.17
DIR-2
  Bottom 0.813: B4.8 6.08,29.21 8.62,31.75 12.7,31.75 13.97,33.02 13.97,40.64 16.51,43.18 B2.9
GND  (via drill 1, 1 pad 1.78)  (14 unrouted)
  Top 0.508: 4.81,148.19 U1.4 7.73,148.19 8.11,148.57 8.11,153.97 C5.2 | 4.81,148.19 3.66,148.19 JP6.2 | A0$1.1 6.71,146.28 4.81,148.19 | 20.81,148.19 U2.4 23.73,148.19 24.11,148.57 24.11,153.97 C6.2 | 20.81,148.19 19.66,148.19 JP7.2 | A0$2.1 22.71,146.28 20.81,148.19 | 35.81,148.19 U3.4 38.73,148.19 39.11,148.57 39.11,153.97 C7.2 | 35.81,148.19 34.66,148.19 JP8.2 | A0$3.1 37.71,146.28 35.81,148.19
  Top 0.813: v26.67,64.77 v26.67,57.15 | v31.48,22.86 v31.48,18.41 | v12.7,48.26 v12.7,59.69
  Bottom 0.61: JP2.2 81.19,13.21 79.67,13.21 76.62,10.16 76.62,4.36 OPTO1.LED_K 78.53,2.15 79.67,1.02 87.29,1.02 87.8,1.52 87.8,6.51 R7.2 | JP3.2 81.19,29.21 79.67,29.21 76.62,26.16 76.62,20.36 OPTO2.LED_K 78.53,18.15 79.67,17.02 87.29,17.02 87.8,17.52 87.8,22.5 R9.2 | JP4.2 81.19,45.21 79.67,45.21 76.62,42.16 76.62,36.36 OPTO3.LED_K 78.53,34.15 79.67,33.02 87.29,33.02 87.8,33.52 87.8,38.51 R11.2 | JP5.2 81.19,61.21 79.67,61.21 76.62,58.16 76.62,52.36 OPTO4.LED_K 78.53,50.15 79.67,49.02 87.29,49.02 87.8,49.52 87.8,54.51 R13.2 | R15.2 7.62,133.58 7.62,131.48 8.62,130.73 OPTO5.LED_K | R17.2 8.32,123.73 OPTO6.LED_K | JP11.2 81.19,77.21 79.67,77.21 76.62,74.16 76.62,68.36 OPTO7.LED_K 78.53,66.15 79.67,65.02 87.29,65.02 87.8,65.52 87.8,70.5 R19.2 | JP12.2 92.62,117.53 91.98,116.9 88.17,116.9 87.54,117.53 87.54,125.47 86.91,126.11 86.91,127.69 | OPTO8.LED_K 89.44,144.84 86.91,142.3 86.91,127.69 | R21.2 86.97,127.63 86.91,127.69 | JP13.2 79.62,117.53 78.98,116.9 75.17,116.9 74.54,117.53 74.54,125.47 73.91,126.11 73.91,127.69 | OPTO9.LED_K 76.44,144.84 73.91,142.3 73.91,127.69 | R23.2 73.97,127.63 73.91,127.69 | JP14.2 66.62,117.53 65.98,116.9 62.17,116.9 61.54,117.53 61.54,125.47 60.91,126.11 60.91,127.69 | OPTO10.LED_K 63.44,144.84 60.91,142.3 60.91,127.69 | R25.2 60.97,127.63 60.91,127.69 | JP9.2 53.62,117.53 52.98,116.9 49.17,116.9 48.54,117.53 48.54,125.47 47.91,126.11 47.91,127.69 | OPTO11.LED_K 50.45,144.84 47.91,142.3 47.91,127.69 | R27.2 47.97,127.63 47.91,127.69
  Bottom 0.813: B2.4 B2.3 | B4.9 6.08,16.51 27.67,16.51 | v26.67,57.15 24.13,57.15 22.86,58.42 B2.3 | v12.7,59.69 8.89,59.69 7.62,58.42 J3.2 | v12.7,59.69 15.24,59.69 16.51,58.42 B2.3 | J2.2 J2.5 11.43,46.99 v12.7,48.26 | R1.1 51.8,17.14 | v31.48,18.41 31.48,16.51 | R4.1 26.09,20.64 28.3,22.86 v31.48,22.86 | R2.1 54.61,34.29 | v12.7,59.69 12.7,64.26 C1.- | D1.A 33.02,69.85 31.75,68.58 27.94,68.58 26.67,67.31 v26.67,64.77 29.21,64.77 33.02,60.96 B2.23 36.83,60.96 39.37,58.42 JP1.8 44.12,55.88 45,55 45,54.27 J4.2 J5.2 | SJ8.1 12.86,105
  Bottom 1.422: 54.61,16.51 54.61,34.29 54.61,52.72 53.34,53.99 | 54.61,16.51 51.8,16.51 49.26,16.51 34.02,16.51 31.48,16.51 27.67,16.51 22.59,16.51 21.32,15.24 B4.15 | C3.- 54.61,16.51 | C4.- 27.67,15.88 | B3.9 34.02,15.88 | B3.15 49.26,15.88 | X3.1 48.28,100.36 48.26,100.33 | 48.26,100.33 45.72,97.79 43.18,97.79 | 43.18,97.79 38.15,97.79 38.12,97.81 X2.1 38.1,104.17 38.1,106.68 36.83,107.95 29.21,107.95 | 53.34,53.99 49.53,57.8 49.53,60.96 | 49.53,60.96 49.53,91.44 | 49.53,91.44 49.53,99.06 48.26,100.33 | X4.1 27.94,104.14 27.94,106.68 29.21,107.95 | T1.P$1 49.53,91.44 | 36.83,60.96 49.53,60.96 | C2.- 53.34,53.99 | X1.1-4 X1.2-4 X1.3-4 12.86,105 12.86,106.84 13.97,107.95 29.21,107.95 | B1.2 6.5,92.56 8.89,90.17 | 8.89,90.17 40.94,90.17 B1.1 | 8.89,90.17 11.43,87.63 11.43,78.74 12.7,77.47 26.67,77.47 D1.A | 43.18,97.79 43.18,92.71
  Bottom 1.676: 49.26,16.51 49.26,15.88 | 34.02,16.51 34.02,15.88 | 27.67,16.51 27.67,15.88 | 51.8,16.51 51.8,17.14
  pour Bottom (isolate 0.508): 96,0 69,0 69,15 96,15
  pour Top (isolate 0.508, rank 2): 69,0 96.05,0 96.05,15.11 69,15.11
  pour Bottom (isolate 0.508): 96,16 69,16 69,31 96,31
  pour Top (isolate 0.508, rank 2): 69,16 96.05,16 96.05,31.11 69,31.11
  pour Bottom (isolate 0.508): 96,32 69,32 69,47 96,47
  pour Top (isolate 0.508, rank 2): 69,32 96.05,32 96.05,47.11 69,47.11
  pour Bottom (isolate 0.508): 96,48 69,48 69,63 96,63
  pour Top (isolate 0.508, rank 2): 69,48 96.05,48 96.05,63.11 69,63.11
  pour Bottom: 1,155.25 1,144 14,144 14,155.25
  pour Bottom: 17,155.25 17,144 30,144 30,155.25
  pour Bottom: 32,155.25 32,144 45,144 45,155.25
  pour Bottom (isolate 0.508): 33.6,117 0,117 0,139.62 33.6,139.62
  pour Top (isolate 0.508, rank 2): 0,117 32.89,117 32.89,139.73 0,139.73
  pour Bottom (isolate 0.508): 96,64 69,64 69,79 96,79
  pour Top (isolate 0.508, rank 2): 69,64 96.05,64 96.05,79.11 69,79.11
  pour Bottom (isolate 0.508): 86,156.27 85,113.72 97.06,113.72 98.06,156.27
  pour Top (isolate 0.508, rank 2): 85,155 85,113.72 97.06,113.72 97.06,155
  pour Bottom (isolate 0.508): 73,156.27 72,113.72 84.06,113.72 85.06,156.27
  pour Top (isolate 0.508, rank 2): 72,155 72,113.72 84.06,113.72 84.06,155
  pour Bottom (isolate 0.508): 60,156.27 59,113.72 71.06,113.72 72.06,156.27
  pour Top (isolate 0.508, rank 2): 59,155 59,113.72 71.06,113.72 71.06,155
  pour Bottom (isolate 0.508): 47,156.27 46,113.72 58.06,113.72 59.06,156.27
  pour Top (isolate 0.508, rank 2): 46,155 46,113.72 58.06,113.72 58.06,155
I2C_SCL  (2 unrouted)
  Top 0.508: U1.2 3.66,150.73 JP6.3 | U2.2 19.66,150.73 JP7.3 | U3.2 34.66,150.73 JP8.3
I2C_SDA  (2 unrouted)
  Top 0.508: U1.1 5.7,152 3.79,153.9 JP6.4 | U2.1 21.7,152 19.79,153.9 JP7.4 | U3.1 36.7,152 34.79,153.9 JP8.4
IO1
  Bottom 0.813: B2.20 35.56,53.34 38.1,50.8 JP1.6
IO2
  Bottom 0.813: B2.19 35.56,50.8 38.1,48.26 JP1.5
IO3
  Bottom 0.813: B2.18 35.56,48.26 38.1,45.72 JP1.4
IO4
  Bottom 0.813: B2.16 JP1.3
IO5
  Bottom 0.813: B2.15 JP1.2
IO6
  Bottom 0.813: B2.14 JP1.1 LED1.A
M_EN  (via drill 1 pad 1.78)
  Top 0.813: v31.48,31.75 v23.86,31.75
  Bottom 0.813: B4.1 v23.86,31.75 21.59,34.02 21.59,36.83 20.32,38.1 B2.11 | B3.1 51.8,29.21 50.53,30.48 37.83,30.48 36.56,31.75 v31.48,31.75
MS1
  Bottom 0.61: B3.2 SJ1.2 49.45,22.54
  Bottom 0.813: R1.2 49.45,22.54
MS2
  Bottom 0.61: SJ2.2 B3.3
MS3
  Bottom 0.61: SJ3.2 B3.4
MS4
  Bottom 0.813: B4.2 SJ5.2 24.94,22.35 R4.2
MS5
  Bottom 0.813: SJ6.2 B4.3
MS6
  Bottom 0.813: SJ7.2 B4.4
N$1
  Bottom 0.813: B3.6 B3.5
N$2
  Bottom 0.813: B4.6 B4.5
N$3
  Bottom 0.813: B2.24 36.83,63.5 37.47,64.14 SJ4.1
N$4
  Bottom 0.61: OPTO1.LED_A 78.53,7.2 R6.1
N$5
  Bottom 0.61: LED2.K 93.13,10.68 93.13,8.89 92.32,8.08 R7.1
N$6
  Bottom 0.813: LED1.K R2.2
N$7
  Bottom 0.61: OPTO1.NPN_C 83.56,5.01 Q1.B
N$8
  Bottom 0.61: OPTO2.LED_A 78.53,23.2 R8.1
N$9
  Bottom 0.61: LED3.K 93.13,26.68 93.13,24.89 92.32,24.08 R9.1
N$10
  Bottom 0.61: OPTO2.NPN_C 83.56,21.02 Q2.B
N$11
  Bottom 0.61: OPTO3.LED_A 78.53,39.2 R10.1
N$12
  Bottom 0.61: LED4.K 93.13,42.67 93.13,40.89 92.32,40.08 R11.1
N$13
  Bottom 0.61: OPTO3.NPN_C 83.56,37.02 Q3.B
N$14
  Bottom 0.61: OPTO4.LED_A 78.53,55.2 R12.1
N$15
  Bottom 0.61: LED5.K 93.13,58.67 93.13,56.89 92.32,56.08 R13.1
N$16
  Bottom 0.61: OPTO4.NPN_C 83.56,53.02 Q4.B
N$17
  Top 0.508: A0$1.2 9.12,147.55 9.76,148.19 U1.5
N$18
  Top 0.508: A0$2.2 25.12,147.55 25.76,148.19 U2.5
N$19
  Top 0.508: A0$3.2 40.12,147.55 40.76,148.19 U3.5
N$20
  Bottom 0.61: OPTO11.LED_A 52.98,142.62 R26.1
N$21
  Bottom 0.61: OPTO5.LED_A 11.43,131.04 11.43,130.97 11.75,130.65 R14.1
N$22
  Bottom 0.61: LED6.K 6.67,138.27 R15.1
N$23
  Bottom 0.61: Q5.B 15.33,130.73 OPTO5.NPN_C
N$24
  Bottom 0.61: R16.1 19.56,120.81 18.54,121.83 18.54,126.91 17.53,127.92 10.85,127.92 OPTO6.LED_A
N$25
  Bottom 0.61: LED7.K 6.67,118.59 R17.1
N$26
  Bottom 0.61: Q6.B 13.95,123.73 OPTO6.NPN_C
N$27
  Bottom 0.61: OPTO7.LED_A 78.53,71.2 R18.1
N$28
  Bottom 0.61: LED8.K 93.13,74.67 93.13,72.89 92.32,72.08 R19.1
N$29
  Bottom 0.61: OPTO7.NPN_C 83.56,69.02 Q7.B
N$30
  Bottom 0.61: OPTO8.LED_A 91.98,142.62 R20.1
N$31
  Bottom 0.61: R21.1 LED9.K
N$32
  Bottom 0.61: Q8.B 94.36,134.22 92.62,135.95 91.36,135.95 OPTO8.NPN_C
N$33
  Bottom 0.61: OPTO9.LED_A 78.98,142.62 R22.1
N$34
  Bottom 0.61: R23.1 LED10.K
N$35
  Bottom 0.61: Q9.B 81.36,134.22 79.62,135.95 78.36,135.95 OPTO9.NPN_C
N$36
  Bottom 0.61: OPTO10.LED_A 65.98,142.62 R24.1
N$37
  Bottom 0.61: R25.1 LED11.K
N$38
  Bottom 0.61: Q10.B 68.36,134.22 66.62,135.95 65.36,135.95 OPTO10.NPN_C
N$39
  Bottom 0.61: R27.1 LED12.K
N$40
  Bottom 0.61: Q11.B 55.35,134.22 53.62,135.95 52.36,135.95 OPTO11.NPN_C
PE  (via drill 1)
  Bottom 0.813: SJ8.2 20,105 20.26,105.26 X1.M1
  other vias: 43.18,80.01 43.18,82.55 43.18,85.09
  pour Bottom (isolate 1.27, rank 2): 0,109.22 0,0 67.31,0 67.31,109.22
  pour Top (isolate 0.61, rank 2): 0,109.22 0,0 67.31,0 67.31,109.22
SCL
  Bottom 0.813: J1.1 11.43,54.61 15.24,50.8 B2.6 R5.1
SDA
  Bottom 0.813: J1.2 12.7,57.15 16.51,53.34 B2.5 R3.1
SIG1
  Bottom 0.61: LED6.A 12.7,137.32 Q5.C 24.81,135.88 26.16,134.53 30.48,134.53 32,133 32,128.43 30.56,126.99 JP10.3
SIG2
  Bottom 0.61: Q6.C 11.26,125.97 10.92,125.64 10.92,120.3 LED7.A 11.43,118.27 29.21,118.27 29.46,118.52 JP10.4
SIGNAL  (8 unrouted)
  Bottom 0.61: Q1.C 83.42,9.65 84.24,9.65 85.51,10.92 JP2.3 87.3,11.43 87.78,11.92 LED2.A | Q2.C 83.42,25.65 84.24,25.65 85.51,26.92 JP3.3 87.3,27.43 87.78,27.92 LED3.A | Q3.C 83.42,41.65 84.24,41.65 85.51,42.92 JP4.3 87.3,43.43 87.78,43.92 LED4.A | Q4.C 83.42,57.65 84.24,57.65 85.51,58.92 JP5.3 87.3,59.43 87.78,59.92 LED5.A | Q7.C 83.42,73.65 84.24,73.65 85.51,74.92 JP11.3 87.3,75.43 87.78,75.92 LED8.A | Q8.C 91.35,122.61 LED9.A JP12.3 | Q9.C 78.35,122.61 LED10.A JP13.3 | Q10.C 65.35,122.61 LED11.A JP14.3 | Q11.C 52.35,122.61 LED12.A JP9.3
STEP-1
  Bottom 0.813: B3.7 36.56,27.94 35.29,29.21 30.21,29.21 28.94,30.48 28.94,34.29 30.21,35.56 B2.13
STEP-2
  Bottom 0.813: B2.10 17.78,40.64 16.51,39.37 16.51,30.48 15.24,29.21 9.89,29.21 8.62,27.94 B4.7
SW1
  Bottom 0.813: J2.1 12.7,44.45 16.51,48.26 B2.7
SW2
  Bottom 0.813: J2.6 7.62,41.91 12.7,41.91 16.51,45.72 B2.8
VCC  (via drill 1)  (10 unrouted)
  Top 1.422: v46.35,64.14 v54.61,64.14
  Bottom 0.61: Q1.E 80.43,7.88 JP2.1 79.92,11.43 78.57,10.08 R6.2 | Q2.E 80.43,23.88 JP3.1 79.92,27.43 78.57,26.08 R8.2 | Q3.E 80.43,39.88 JP4.1 79.92,43.43 78.57,42.08 R10.2 | Q4.E 80.43,55.88 JP5.1 79.92,59.43 78.57,58.08 R12.2 | Q6.E 11.94,123.71 11.94,122.08 14.73,119.29 25.4,119.29 26.67,120.56 26.67,120.81 | Q5.E 11.75,132.43 13.72,130.46 13.72,129.77 R14.2 14.16,129.19 17.53,129.19 18.29,128.43 26.67,128.43 | 26.67,120.81 26.67,128.43 | 26.67,128.43 26.67,131.48 27.18,131.99 29.38,131.99 JP10.1 | R16.2 26.67,120.81 | Q7.E 80.43,71.88 JP11.1 79.92,75.43 78.57,74.08 R18.2 | R20.2 95.16,142.94 95.16,137.22 95.8,136.59 95.8,119.44 JP12.1 94.36,119.61 Q8.E | R22.2 82.16,142.94 82.16,137.22 82.8,136.59 82.8,119.44 JP13.1 81.36,119.61 Q9.E | R24.2 69.16,142.94 69.16,137.22 69.8,136.59 69.8,119.44 JP14.1 68.36,119.61 Q10.E | R26.2 56.16,142.94 56.16,137.22 56.8,136.59 56.8,119.44 JP9.1 55.35,119.61 Q11.E
  Bottom 0.813: SJ4.2 45.72,64.14 v46.35,64.14 | 52.7,64.14 52.07,63.5
  Bottom 1.422: C4.+ 30.21,11.7 28.67,10.16 28.67,9 | 28.67,9 28.67,7.62 29.94,6.35 31.65,6.35 32,6 32,5.56 35.02,2.54 54.34,2.54 57.15,6.35 57.15,10.16 C3.+ 57.15,52.72 | B1.4 43.5,74.93 43.5,66.36 45.72,64.14 | B3.16 51.8,12.7 54.34,10.16 56.52,10.16 | X2.2 43.18,104.17 43.18,106.68 44.45,107.95 50.8,107.95 53.31,105.44 X3.2 53.34,104.11 53.34,100.33 52.07,97.79 52.07,82.55 | 52.07,82.55 52.07,63.5 52.07,59.07 57.15,53.99 57.15,52.72 | v54.61,64.14 52.7,64.14 | T2.P$1 52.07,82.55 | C2.+ 57.15,52.72 | B4.16 24.03,13.97 28,10 28,9.67 28.67,9
  Bottom 1.676: 57.15,10.16 56.52,10.16

### Text on the board
Top: v2 | v2 | v2 | v2 | + / - / 1 / 2 | T | + / - / S | + / - / S | + / - / S | + / - / S | +5V | +VCC | +VCC | TOP | v2 | + / - / S | PE | + / - / S | TOP | v2 | + / - / S | TOP | v2 | + / - / S | TOP | v2 | + / - / S | TOP | v2 | ELEVATION | AZIMUTH
Bottom: LM75 | LM75 | LM75 | + / - / S | + / - / S | + / - / S | + / - / S | BOTTOM | S / - / + | S / - / + | BOT | S / - / + | BOT | S / - / + | BOT | S / - / + | BOT
tPlace: D / C / G / + | D / C / G / + | D / C / G / + | 1 | 1 | 1 | - + | - + | - + | SatNOGS V2 | PE | I2C | - | + | - / + | D / C | 1 / 2 / 3 / 4 / 5 / 6 | + | - | + / - / S2 | + / - / S1 | SW | 1B 1A 2A 2B | 1B 1A 2A 2B | ELEVATION
bPlace: SatNOGS V2
tValues: v2 | v2 | v2 | v2 | v2 | v2 | v2 | v2 | v2
Reference: Eagle Freeware: 100x80mm | Euro: 160x100mm
_tNames: X4 | X2 | X3 | T1 | T2 | D1 | C1 | B2 | LED1 | JP1 | C2 | J4 | OPTO1 | J5 | LED1 | JP1 | JP1 | OPTO1 | LED1 | LED1 | JP1 | OPTO1 | LED1 | JP1 | C4 | C3 | OPTO1 | X6 | X5
_bNames: SJ8 | SJ4 | R2 | R3 | R1 | Q1 | R5 | R2 | R1 | Q1 | R2 | R2 | R1 | Q1 | R4 | R1 | SJ7 | SJ6 | SJ5 | SJ3 | SJ2 | SJ1 | R2 | R1 | Q1
_bValues: SJ1